# EAGLE design PCB_Plate (EAGLE 5.11)
CAPACITANCE: ?; DESCRIPTION: Intertia and Localization Interfaces; NOTES: No Stuff; REV: A

## Sheet 1 of 7
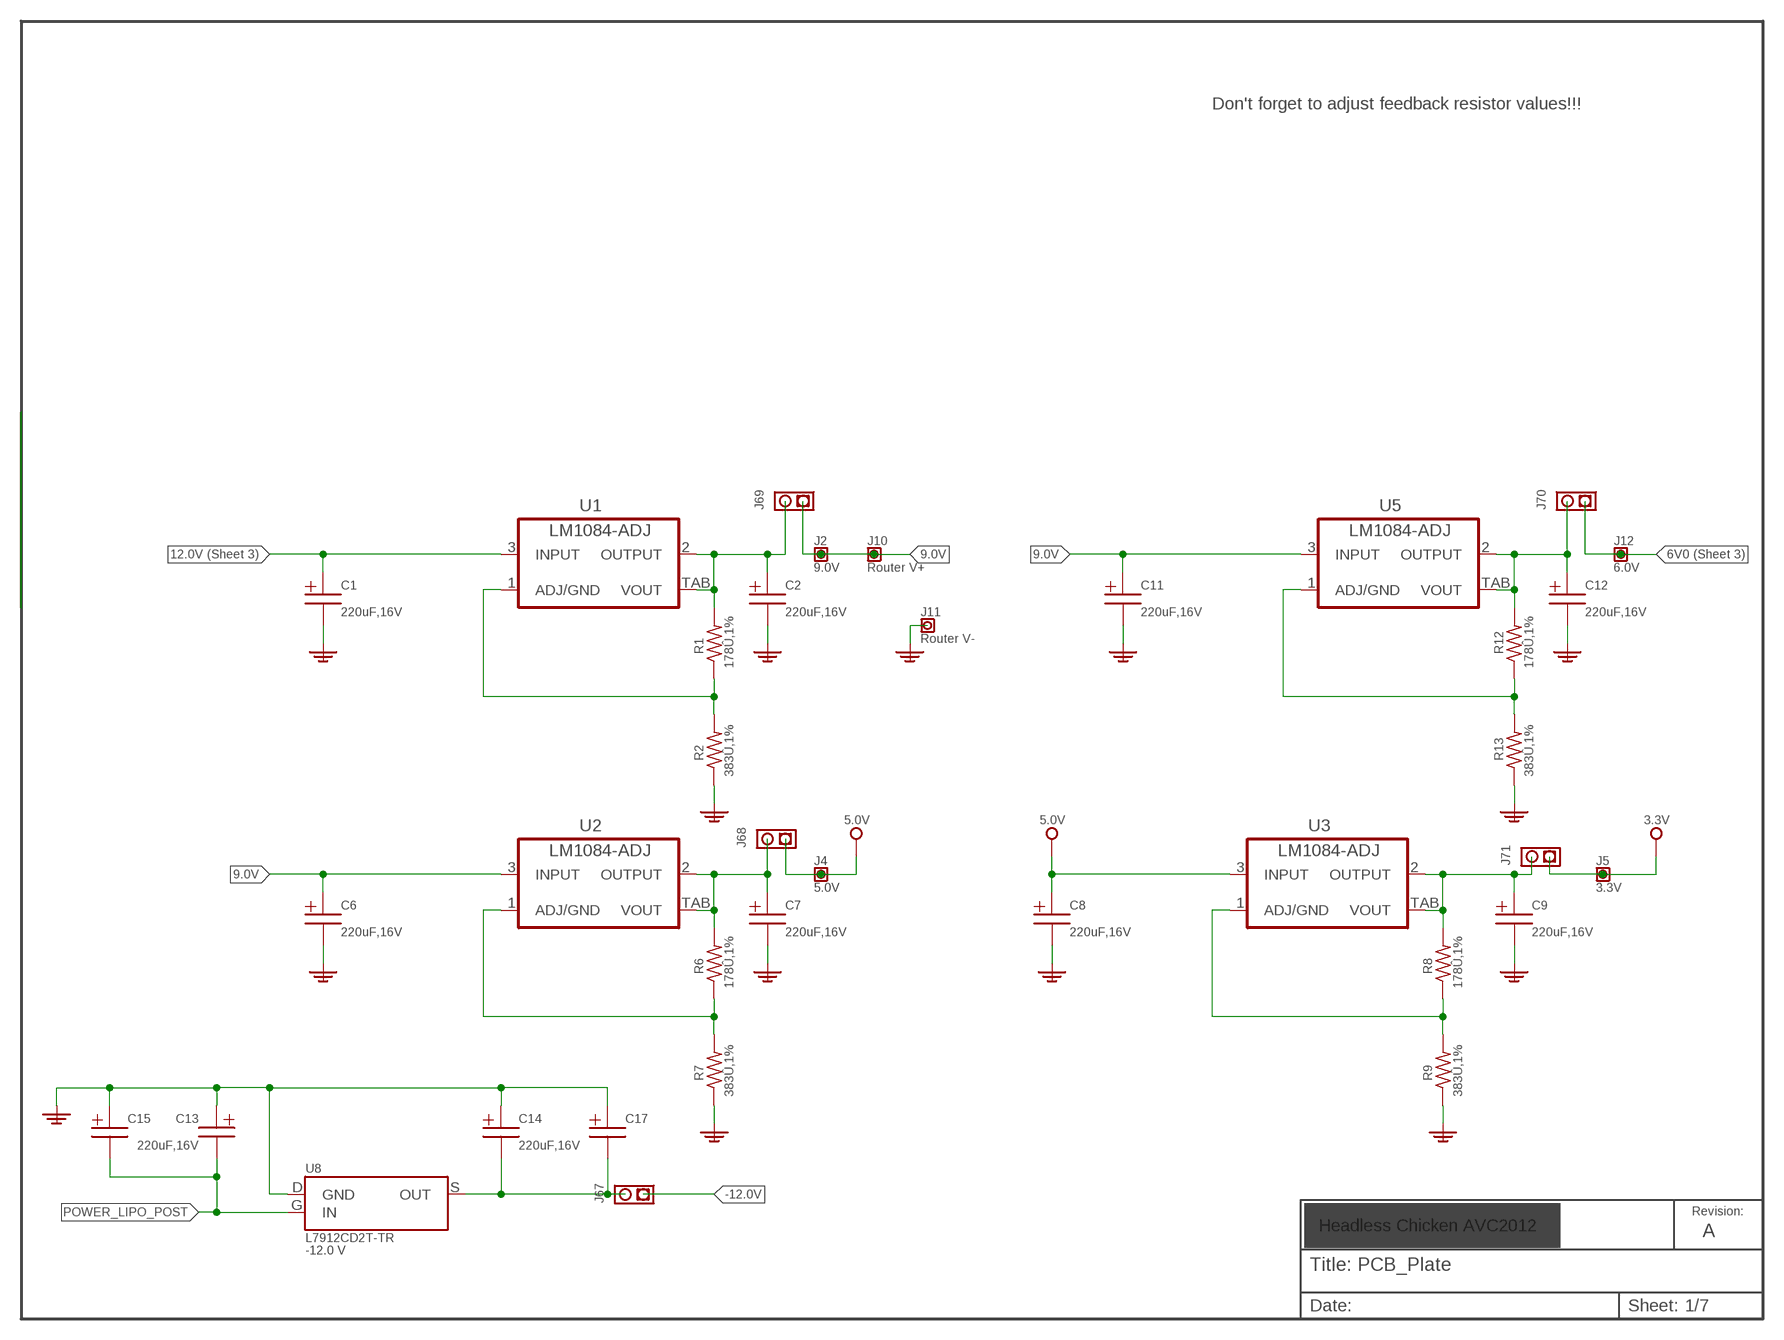
[diagram p0: schematic, sheet 1]

### Parts
C1  T491D227K016ZT  [SMC_D]
C2  T491D227K016ZT  [SMC_D]
C6  T491D227K016ZT  [SMC_D]
C7  T491D227K016ZT  [SMC_D]
C8  T491D227K016ZT  [SMC_D]
C9  T491D227K016ZT  [SMC_D]
C11  T491D227K016ZT  [SMC_D]
C12  T491D227K016ZT  [SMC_D]
C13  T491D227K016ZT  [SMC_D]
C14  T491D227K016ZT  [SMC_D]
C15  CAP_POLARIZED  [PANASONIC_NHG_A]
C17  CAP_POLARIZED  [PANASONIC_NHG_A]
J2  9.0V  BOARD00003WVALUE  [TSW1X1_VAL]
J4  5.0V  BOARD00003WVALUE  [TSW1X1_VAL]
J5  3.3V  BOARD00003WVALUE  [TSW1X1_VAL]
J10  Router V+  BOARD00003WVALUE  [TSW1X1_VAL]
J11  Router V-  BOARD00003WVALUE  [TSW1X1_VAL]
J12  6.0V  BOARD00003WVALUE  [TSW1X1_VAL]
J67  BOARD00012  [TSW1X2]
J68  BOARD00012  [TSW1X2]
J69  BOARD00012  [TSW1X2]
J70  BOARD00012  [TSW1X2]
J71  BOARD00012  [TSW1X2]
R1  ERJ-3EKF1780V  [R0603@1]
R2  on  ERJ-3EKF3830V  [R0603@1]
R6  ERJ-3EKF1780V  [R0603@1]
R7  on  ERJ-3EKF3830V  [R0603@1]
R8  ERJ-3EKF1780V  [R0603@1]
R9  on  ERJ-3EKF3830V  [R0603@1]
R12  ERJ-3EKF1780V  [R0603@1]
R13  on  ERJ-3EKF3830V  [R0603@1]
U1  LM1084IS-ADJ  [TO263-3]
U2  LM1084IS-ADJ  [TO263-3]
U3  LM1084IS-ADJ  [TO263-3]
U5  LM1084IS-ADJ  [TO263-3]
U8  L7912CD2T-TR  [D2PACK]

### Nets
3V3: J5.P$1 J71.P$1 ; also sheet 2,3,5,6
5V0: C8.+ J4.P$1 J68.P$1 U3.3(INPUT) ; also sheet 3,5
6V0: J12.P$1 J70.P$1 ; also sheet 3,5
9.0V: C6.+ C11.+ J2.P$1 J10.P$1 J69.P$1 U2.3(INPUT) U5.3(INPUT)
12.0V: C1.+ U1.3(INPUT) ; also sheet 3,4
-12.0V: J67.P$1
GND: C1.- C2.- C6.- C7.- C8.- C9.- C11.- C12.- C13.+ C14.+ C15.+ C17.+ J11.P$1 R2.1 R7.1 R9.1 R13.1 U8.D(GND) ; also sheet 2,3,4,5,6
N$1: R1.1 R2.2 U1.1(ADJ/GND)
N$6: R6.1 R7.2 U2.1(ADJ/GND)
N$7: R8.1 R9.2 U3.1(ADJ/GND)
N$8: R12.1 R13.2 U5.1(ADJ/GND)
N$101: C12.+ J70.P$2 R12.2 U5.2(OUTPUT) U5.TAB(VOUT)
N$102: C14.- C17.- J67.P$2 U8.S(OUT)
N$106: C7.+ J68.P$2 R6.2 U2.2(OUTPUT) U2.TAB(VOUT)
N$107: C2.+ J69.P$2 R1.2 U1.2(OUTPUT) U1.TAB(VOUT)
N$109: C9.+ J71.P$2 R8.2 U3.2(OUTPUT) U3.TAB(VOUT)
POWER_LIPO_POST: C13.- C15.- U8.G(IN) ; also sheet 4

### Notes on the sheet
- Don't forget to adjust feedback resistor values!!!
- Headless Chicken AVC2012 | Headless Chicken AVC2012

## Sheet 2 of 7
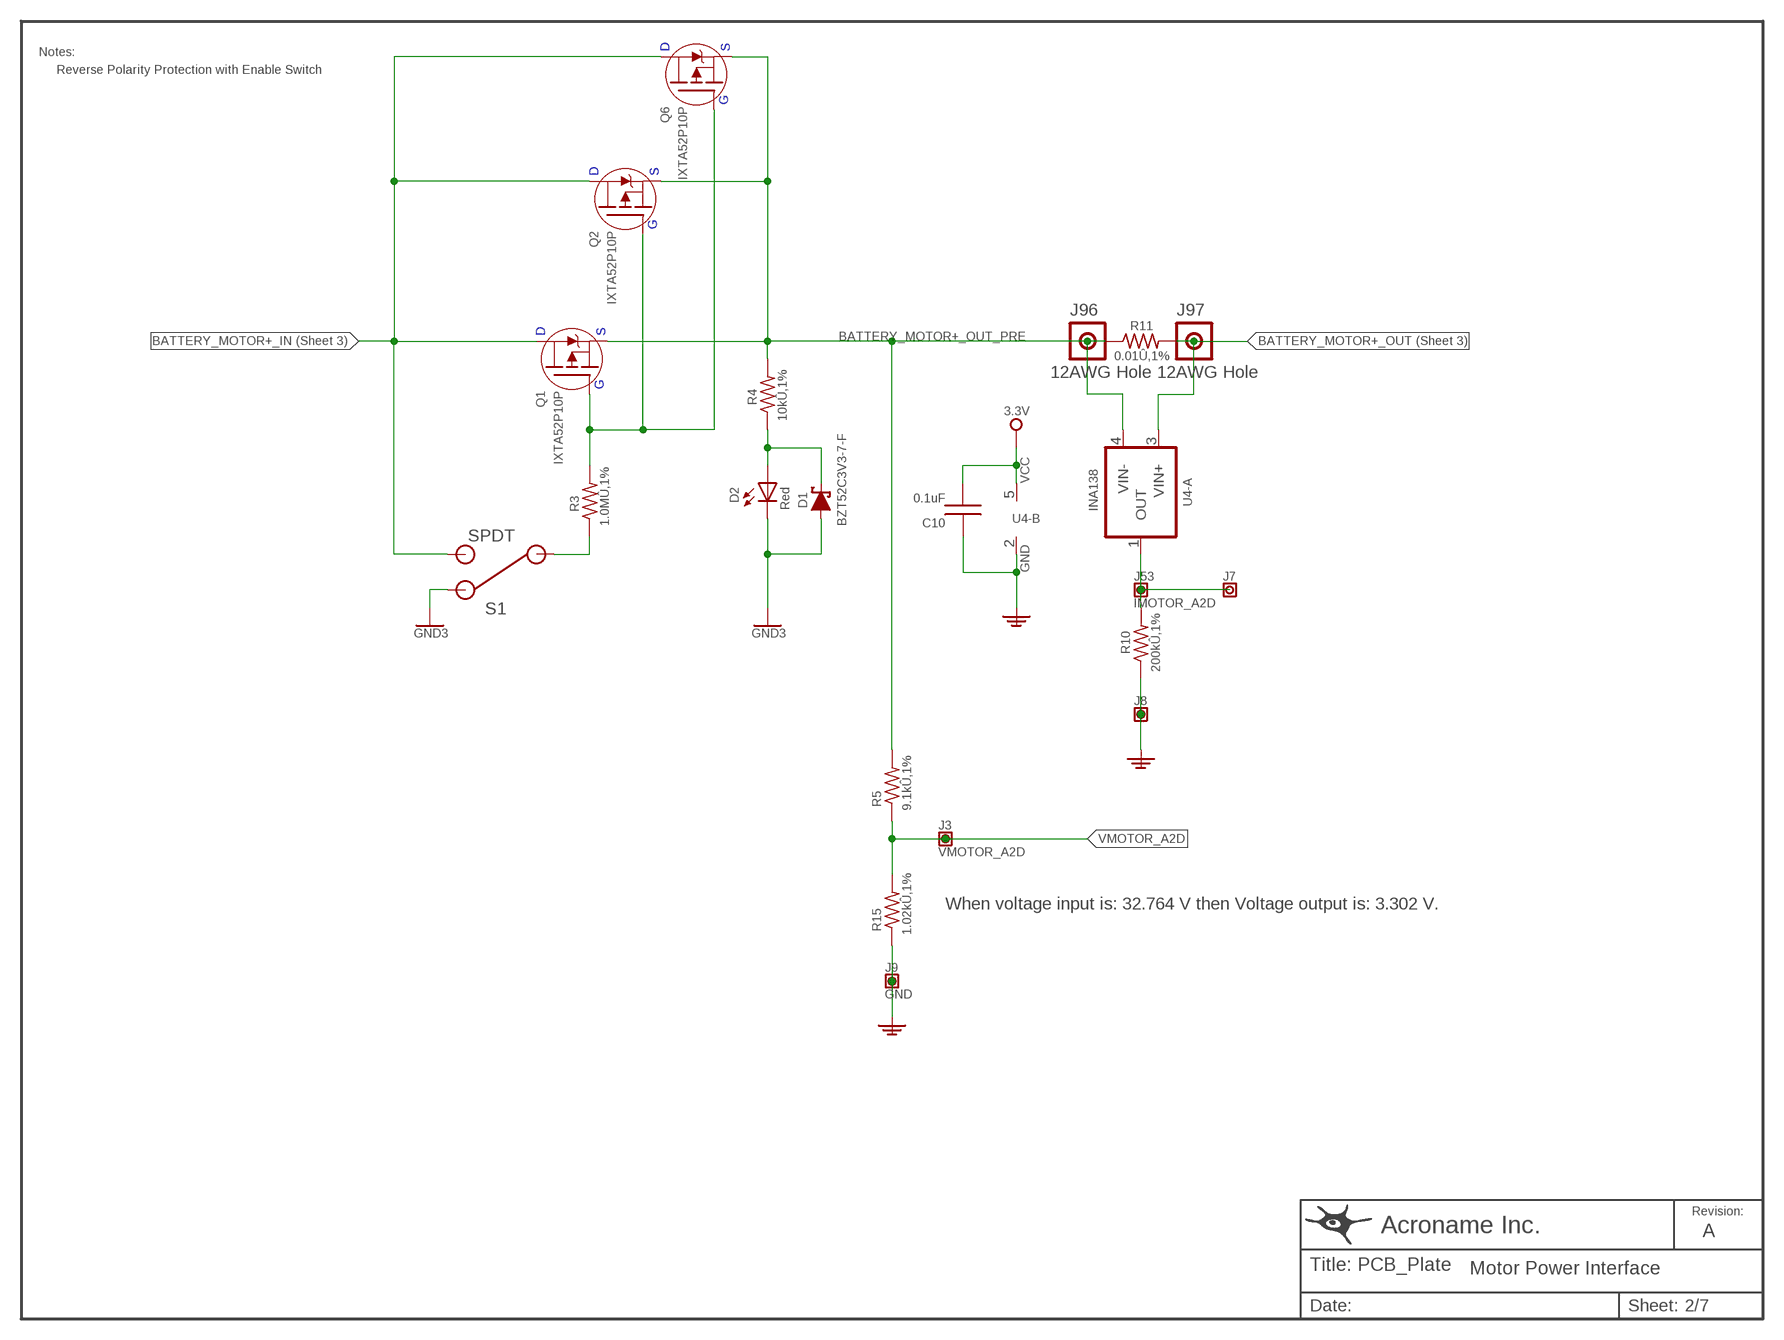
[diagram p1: schematic, sheet 2]

### Parts
C10  PCAPI00015  [C0603]
D1  BZT52C3V3-7-F  [SOD123]
D2  PDIOD00001  [CHIPLED_0805]
J3  VMOTOR_A2D  BOARD00003WVALUE  [TSW1X1_VAL]
J7  BOARD00003WVALUE  [TSW1X1_VAL]
J8  BOARD00003WVALUE  [TSW1X1_VAL]
J9  GND  BOARD00003WVALUE  [TSW1X1_VAL]
J53  IMOTOR_A2D  BOARD00003WVALUE  [TSW1X1_VAL]
J96  BOARD00008  [TSW1X1_12AWG]
J97  BOARD00008  [TSW1X1_12AWG]
Q1  IXTA52P10P  [D2PACK]
Q2  IXTA52P10P  [D2PACK]
Q6  IXTA52P10P  [D2PACK]
R3  ERJ-3EKF1004V  [R0603]
R4  PRESI00005  [R0603]
R5  ERJ-2RKF9101X  [R0402]
R10  PRESI00018  [R0603]
R11  PRESI00041  [R4527]
R15  ERJ-2RKF1021X  [R0402]
S1  PMISC00005  [SPDTRA]
U4  PCHIP00026  [SOT23-5]

### Nets
3V3: C10.2 U4.5(-B:VCC) ; also sheet 1,3,5,6
BATTERY_MOTOR+_IN: Q1.D Q2.D Q6.D S1.3 ; also sheet 3
BATTERY_MOTOR+_OUT: J97.P$1 R11.2 U4.3(-A:VIN+) ; also sheet 3
BATTERY_MOTOR+_OUT_PRE: J96.P$1 Q1.S Q2.S Q6.S R4.2 R5.2 R11.1 U4.4(-A:VIN-)
GND: C10.1 J8.P$1 J9.P$1 R10.1 R15.1 U4.2(-B:GND) ; also sheet 1,3,4,5,6
GND3: D1.C(A) D2.C S1.1 ; also sheet 3
IMOTOR_A2D: J7.P$1 J53.P$1 R10.2 U4.1(-A:OUT)
N$3: Q1.G Q2.G Q6.G R3.2
N$4: D1.A(C) D2.A R4.1
N$5: R3.1 S1.2
VMOTOR_A2D: J3.P$1 R5.1 R15.2
Unconnected: S1.4 S1.5

### Notes on the sheet
- Notes:
- Reverse Polarity Protection with Enable Switch
- When voltage input is: 32.764 V then Voltage output is: 3.302 V.
- Motor Power Interface

## Sheet 3 of 7
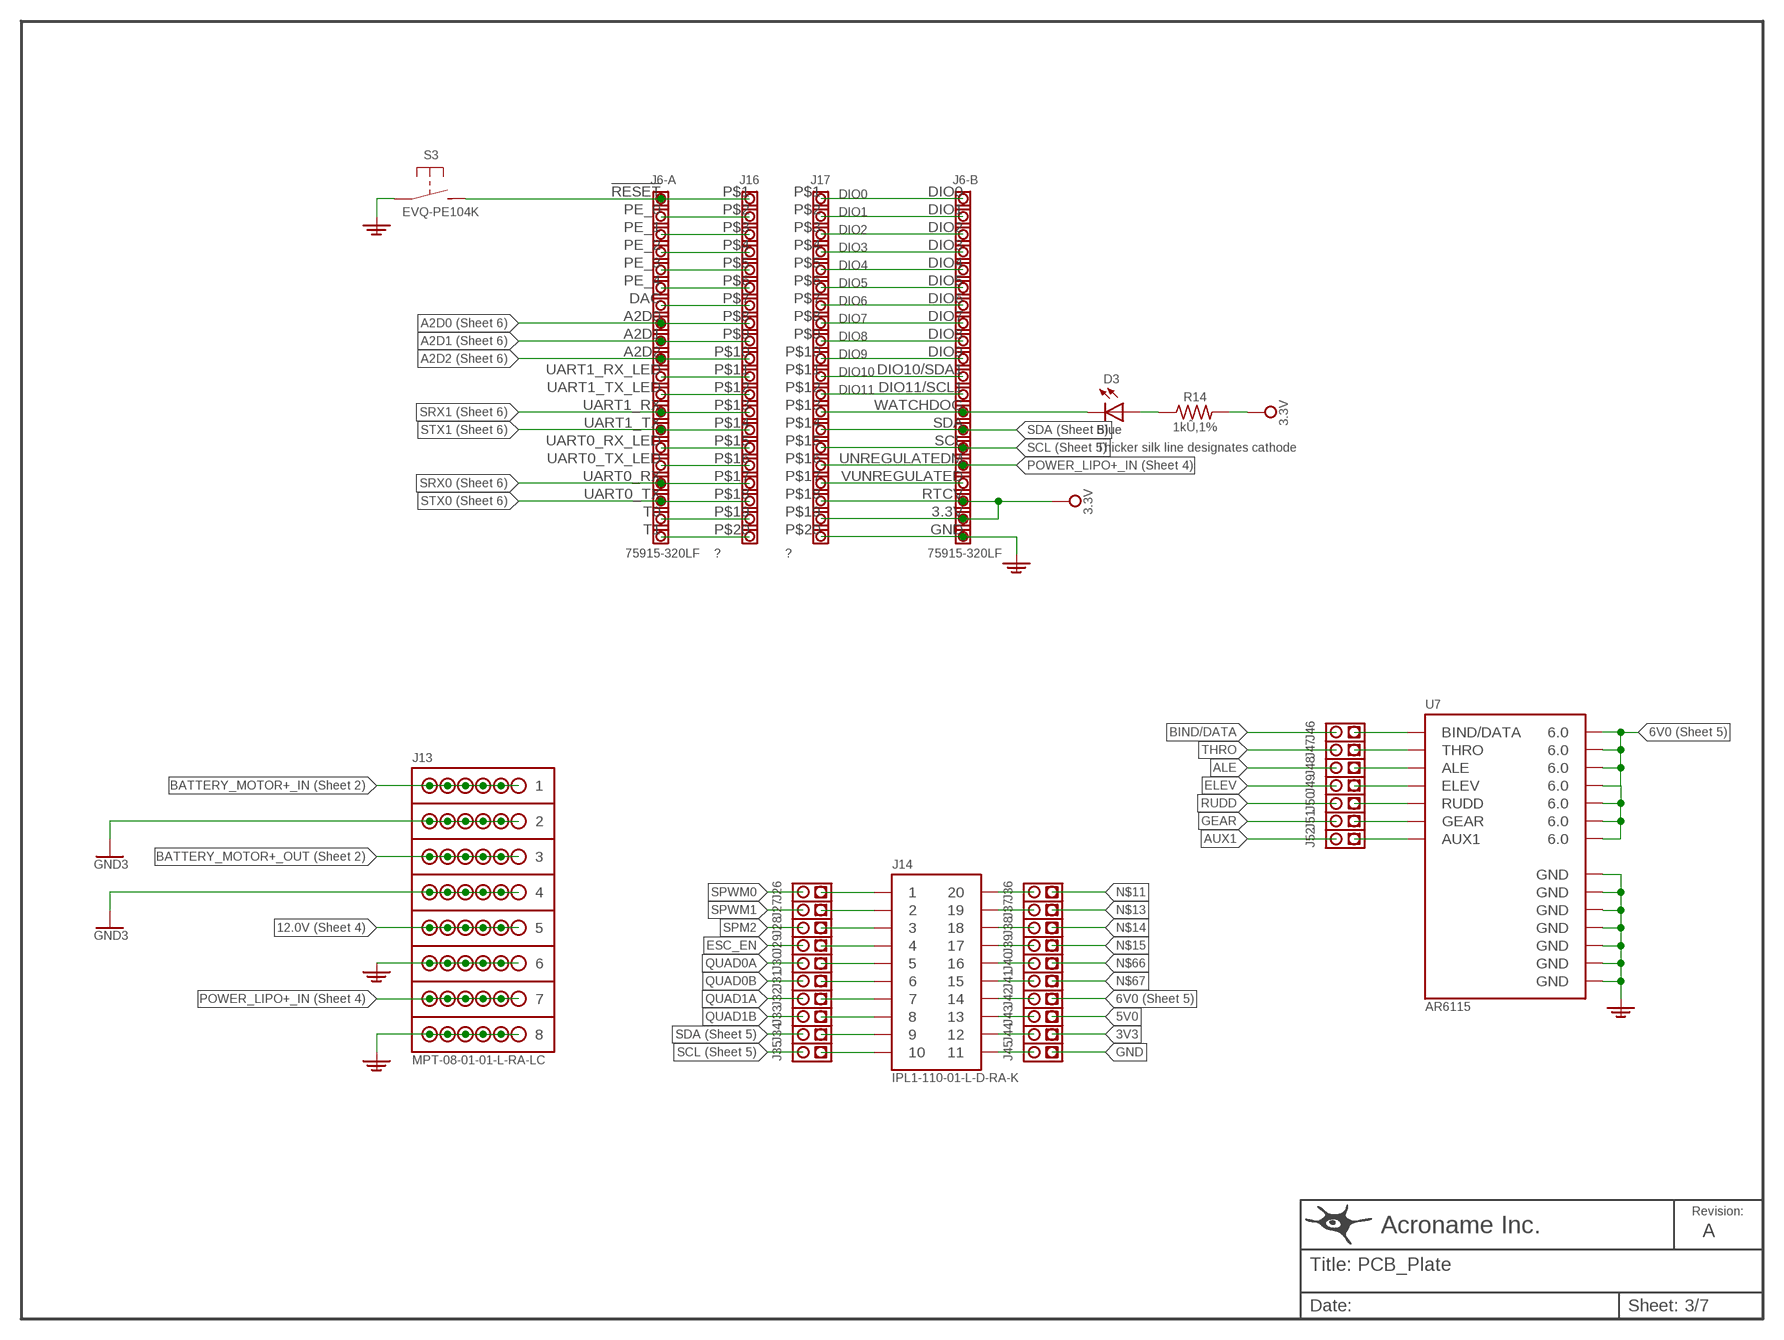
[diagram p2: schematic, sheet 3]

### Parts
D3  LTST-C171TBKT  [CHIPLED_0805]
J6  BRAINSTEMSOCKET_FEMALE  [BRAINSTEMSOCKET]
J13  MPT-08-01-01-L-RA-LC  [MPT-08-XX-X-RA-XX]
J14  IPL1-1XX-02-XXX-DH-K-XX-MKT  [IPL1-110-01-S-RA]
J16  TSW1X20  [TSW1X20]
J17  TSW1X20  [TSW1X20]
J26  BOARD00012  [TSW1X2]
J27  BOARD00012  [TSW1X2]
J28  BOARD00012  [TSW1X2]
J29  BOARD00012  [TSW1X2]
J30  BOARD00012  [TSW1X2]
J31  BOARD00012  [TSW1X2]
J32  BOARD00012  [TSW1X2]
J33  BOARD00012  [TSW1X2]
J34  BOARD00012  [TSW1X2]
J35  BOARD00012  [TSW1X2]
J36  BOARD00012  [TSW1X2]
J37  BOARD00012  [TSW1X2]
J38  BOARD00012  [TSW1X2]
J39  BOARD00012  [TSW1X2]
J40  BOARD00012  [TSW1X2]
J41  BOARD00012  [TSW1X2]
J42  BOARD00012  [TSW1X2]
J43  BOARD00012  [TSW1X2]
J44  BOARD00012  [TSW1X2]
J45  BOARD00012  [TSW1X2]
J46  BOARD00012  [TSW1X2]
J47  BOARD00012  [TSW1X2]
J48  BOARD00012  [TSW1X2]
J49  BOARD00012  [TSW1X2]
J50  BOARD00012  [TSW1X2]
J51  BOARD00012  [TSW1X2]
J52  BOARD00012  [TSW1X2]
R14  PRESI00006  [R0603]
S3  EVQ-PE104K  [SPST-NO]
U7  AR6115  [AR6115]

### Nets
3V3: J6.3.3V J6.RTCV J17.P$18 J17.P$19 J44.P$1 R14.2 ; also sheet 1,2,5,6
5V0: J43.P$1 ; also sheet 1,5
6V0: J42.P$1 U7.VCC@1(6.0) U7.VCC@2(6.0) U7.VCC@3(6.0) U7.VCC@4(6.0) U7.VCC@5(6.0) U7.VCC@6(6.0) U7.VCC@7(6.0) ; also sheet 1,5
12.0V: J13.5@0 J13.5@1 J13.5@2 J13.5@3 J13.5@4 J13.5@5 ; also sheet 1,4
!RESET: J6.!RESET J16.P$1 S3.P$2(S)
A2D0: J6.A2D0 J16.P$8 ; also sheet 6
A2D1: J6.A2D1 J16.P$9 ; also sheet 6
A2D2: J6.A2D2 J16.P$10 ; also sheet 6
ALE: J48.P$2
AUX1: J52.P$2
BATTERY_MOTOR+_IN: J13.1@0 J13.1@1 J13.1@2 J13.1@3 J13.1@4 J13.1@5 ; also sheet 2
BATTERY_MOTOR+_OUT: J13.3@0 J13.3@1 J13.3@2 J13.3@3 J13.3@4 J13.3@5 ; also sheet 2
BIND/DATA: J46.P$2
DIO0: J6.DIO0 J17.P$1 ; also sheet 5
DIO1: J6.DIO1 J17.P$2 ; also sheet 5
DIO2: J6.DIO2 J17.P$3 ; also sheet 5
DIO3: J6.DIO3 J17.P$4 ; also sheet 5
DIO4: J6.DIO4 J17.P$5 ; also sheet 5
DIO5: J6.DIO5 J17.P$6 ; also sheet 5
DIO6: J6.DIO6 J17.P$7
DIO7: J6.DIO7 J17.P$8
DIO8: J6.DIO8 J17.P$9
DIO9: J6.DIO9 J17.P$10
DIO10: J6.DIO10/SDA1 J17.P$11
DIO11: J6.DIO11/SCL1 J17.P$12
ELEV: J49.P$2
ESC_EN: J29.P$2
GEAR: J51.P$2
GND: J6.GND J13.6@0 J13.6@1 J13.6@2 J13.6@3 J13.6@4 J13.6@5 J13.8@0 J13.8@1 J13.8@2 J13.8@3 J13.8@4 J13.8@5 J17.P$20 J45.P$1 S3.P$1(P) U7.GND@1(GND) U7.GND@2(GND) U7.GND@3(GND) U7.GND@4(GND) U7.GND@5(GND) U7.GND@6(GND) U7.GND@7(GND) ; also sheet 1,2,4,5,6
GND3: J13.2@0 J13.2@1 J13.2@2 J13.2@3 J13.2@4 J13.2@5 J13.4@0 J13.4@1 J13.4@2 J13.4@3 J13.4@4 J13.4@5 ; also sheet 2
N$9: D3.A R14.1
N$11: J36.P$1
N$12: D3.C J6.WATCHDOG J17.P$13
N$13: J37.P$1
N$14: J38.P$1
N$15: J39.P$1
N$16: J6.PE_0 J16.P$2
N$17: J6.PE_1 J16.P$3
N$18: J6.PE_2 J16.P$4
N$19: J6.PE_3 J16.P$5
N$20: J6.PE_4 J16.P$6
N$21: J6.DAC J16.P$7
N$22: J6.UART1_RX_LED J16.P$11
N$23: J6.UART1_TX_LED J16.P$12
N$26: J6.UART0_RX_LED J16.P$15
N$27: J6.UART0_TX_LED J16.P$16
N$30: J6.T0 J16.P$19
N$31: J6.T1 J16.P$20
N$44: J6.VUNREGULATED J17.P$17
N$46: J14.1 J26.P$1
N$56: J14.2 J27.P$1
N$57: J14.3 J28.P$1
N$59: J14.4 J29.P$1
N$60: J14.5 J30.P$1
N$61: J14.6 J31.P$1
N$62: J14.7 J32.P$1
N$63: J14.8 J33.P$1
N$64: J14.9 J34.P$1
N$65: J14.10 J35.P$1
N$66: J40.P$1
N$67: J41.P$1
N$68: J14.20 J36.P$2
N$69: J14.19 J37.P$2
N$70: J14.18 J38.P$2
N$71: J14.17 J39.P$2
N$72: J14.16 J40.P$2
N$73: J14.15 J41.P$2
N$74: J14.14 J42.P$2
N$75: J14.13 J43.P$2
N$76: J14.12 J44.P$2
N$77: J14.11 J45.P$2
N$78: J46.P$1 U7.BIND(BIND/DATA)
N$79: J47.P$1 U7.THRO
N$80: J48.P$1 U7.ALE
N$81: J49.P$1 U7.ELEV
N$82: J50.P$1 U7.RUDD
N$83: J51.P$1 U7.GEAR
N$84: J52.P$1 U7.AUX1
POWER_LIPO+_IN: J6.UNREGULATEDM J13.7@0 J13.7@1 J13.7@2 J13.7@3 J13.7@4 J13.7@5 J17.P$16 ; also sheet 4
QUAD0A: J30.P$2
QUAD0B: J31.P$2
QUAD1A: J32.P$2
QUAD1B: J33.P$2
RUDD: J50.P$2
SCL: J6.SCL J17.P$15 J35.P$2 ; also sheet 5,6
SDA: J6.SDA J17.P$14 J34.P$2 ; also sheet 5,6
SPM2: J28.P$2
SPWM0: J26.P$2
SPWM1: J27.P$2
SRX0: J6.UART0_RX J16.P$17 ; also sheet 6
SRX1: J6.UART1_RX J16.P$13 ; also sheet 6
STX0: J6.UART0_TX J16.P$18 ; also sheet 6
STX1: J6.UART1_TX J16.P$14 ; also sheet 6
THRO: J47.P$2

## Sheet 4 of 7
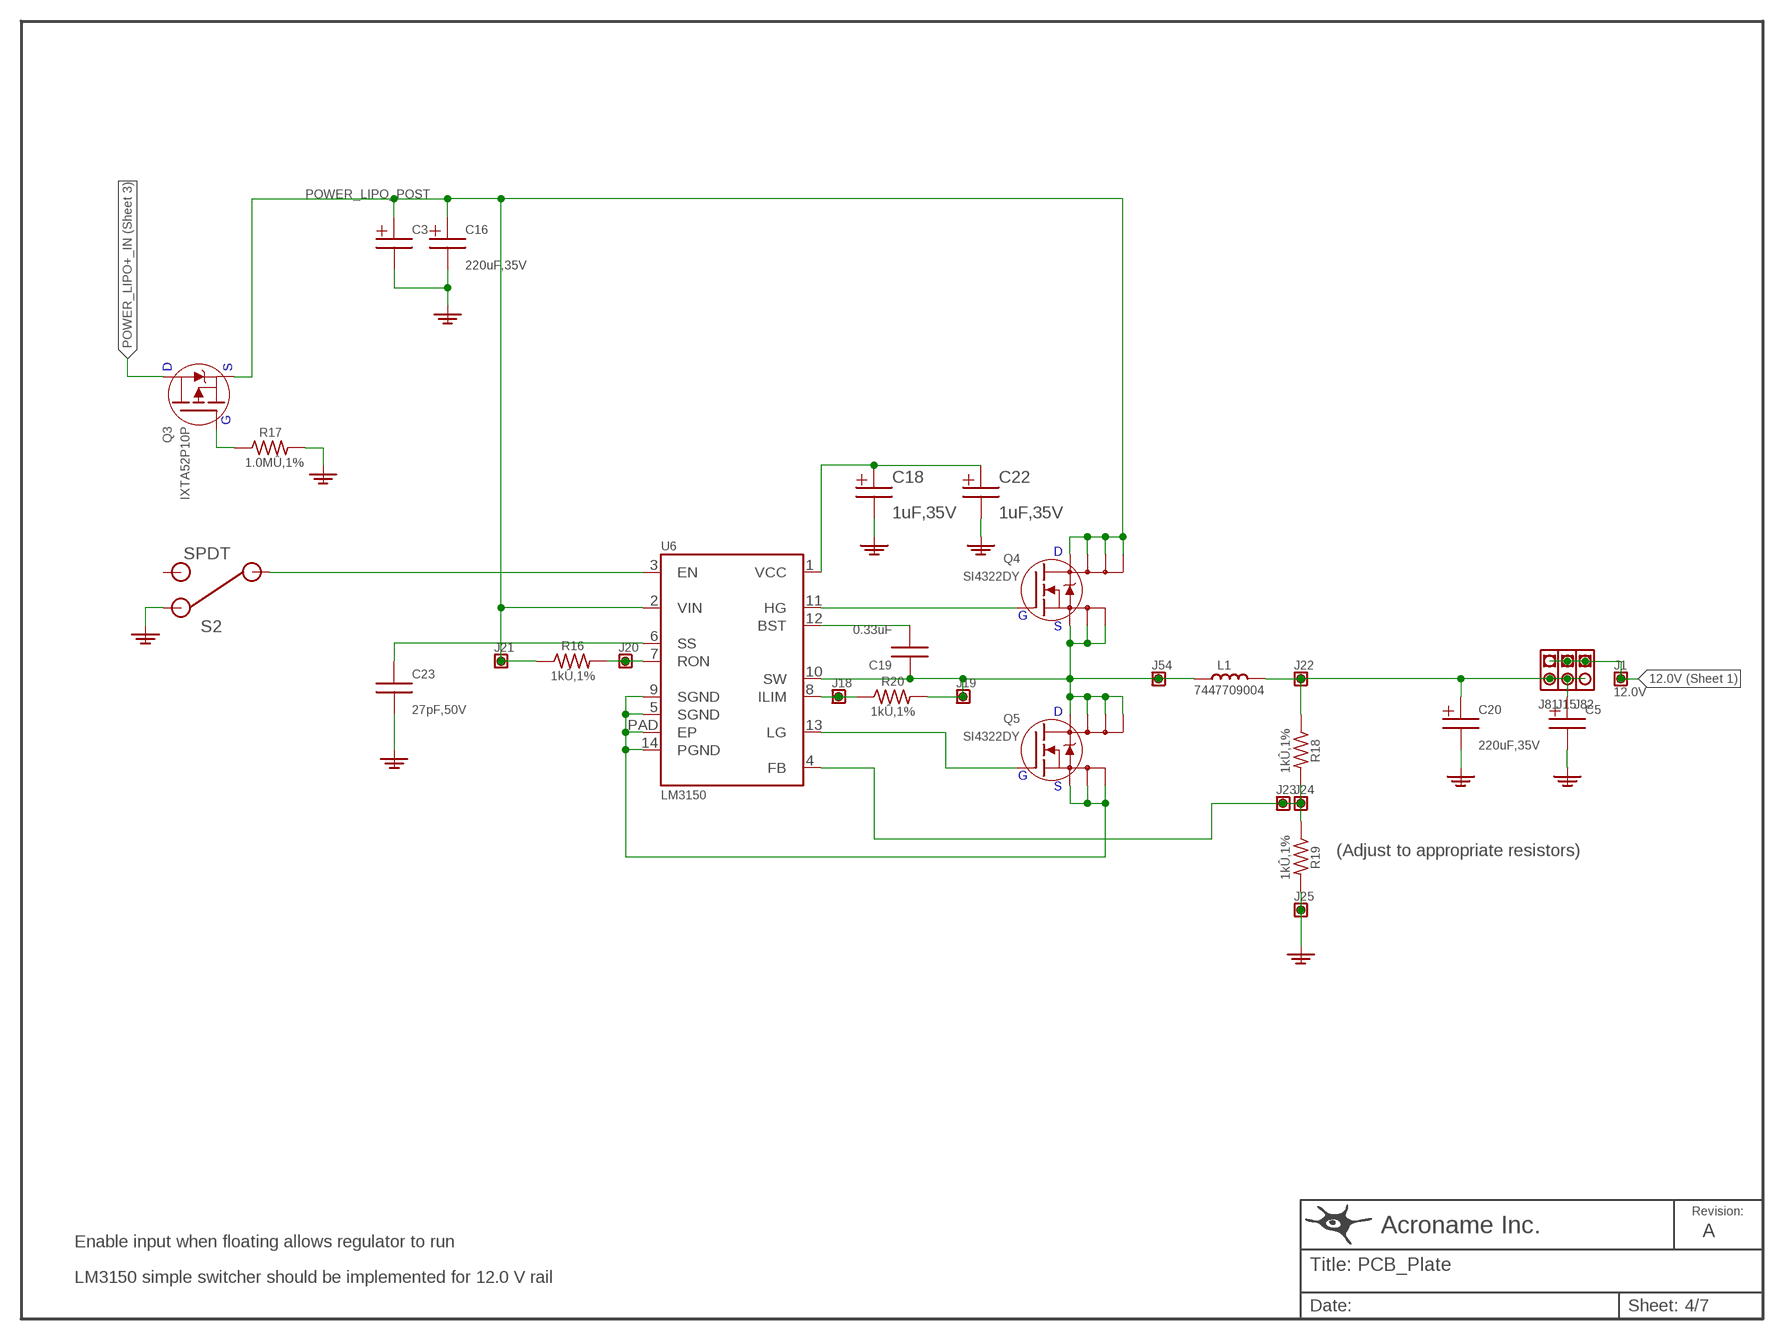
[diagram p3: schematic, sheet 4]

### Parts
C3  CAP_POLARIZED  [PANASONIC_NHG_A]
C5  CAP_POLARIZED  [PANASONIC_NHG_A]
C16  PCAPI00020  [PANASONIC_G]
C18  T491B105K035AT  [T491]
C19  PCAPI00005  [C0603]
C20  PCAPI00020  [PANASONIC_G]
C22  T491B105K035AT  [T491]
C23  ECJ-1VC1H270J  [C0603]
J1  12.0V  BOARD00003WVALUE  [TSW1X1_VAL]
J15  BOARD00012  [TSW1X2]
J18  BOARD00003  [TSW1X1]
J19  BOARD00003  [TSW1X1]
J20  BOARD00003  [TSW1X1]
J21  BOARD00003  [TSW1X1]
J22  BOARD00003  [TSW1X1]
J23  BOARD00003  [TSW1X1]
J24  BOARD00003  [TSW1X1]
J25  BOARD00003  [TSW1X1]
J54  BOARD00003  [TSW1X1]
J81  BOARD00012  [TSW1X2]
J82  BOARD00012  [TSW1X2]
L1  7447709004  [7447709004]
Q3  IXTA52P10P  [D2PACK]
Q4  SI4322DY  [SO-08]
Q5  SI4322DY  [SO-08]
R16  PRESI00006  [R0603]
R17  ERJ-3EKF1004V  [R0603]
R18  PRESI00006  [R0603]
R19  PRESI00006  [R0603]
R20  PRESI00006  [R0603]
S2  PMISC00005  [SPDTRA]
U6  LM3150  [TSSOP14EXP]

### Nets
12.0V: J1.P$1 J15.P$1 J81.P$1 J82.P$1 ; also sheet 1,3
GND: C3.- C5.- C16.- C18.- C20.- C22.- C23.2 J25.P$1 R17.2 R19.2 S2.1 ; also sheet 1,2,3,5,6
N$2: S2.2 U6.3(EN)
N$42: C5.+ C20.+ J15.P$2 J22.P$1 J81.P$2 J82.P$2 L1.2 R18.1
N$45: C18.+ C22.+ U6.1(VCC)
N$47: Q5.1(SA) Q5.2(SB) Q5.3(SC) U6.5(SGND) U6.9(SGND) U6.14(PGND) U6.PAD(EP)
N$48: Q5.4(G) U6.13(LG)
N$49: Q4.4(G) U6.11(HG)
N$50: Q3.G R17.1
N$51: J20.P$1 R16.2 U6.7(RON)
N$52: C19.1 J19.P$1 J54.P$1 L1.1 Q4.1(SA) Q4.2(SB) Q4.3(SC) Q5.5(DA) Q5.6(DB) Q5.7(DC) Q5.8(DD) R20.2 U6.10(SW)
N$53: C19.2 U6.12(BST)
N$54: J23.P$1 J24.P$1 R18.2 R19.1 U6.4(FB)
N$55: J18.P$1 R20.1 U6.8(ILIM)
N$58: C23.1 U6.6(SS)
POWER_LIPO+_IN: Q3.D ; also sheet 3
POWER_LIPO_POST: C3.+ C16.+ J21.P$1 Q3.S Q4.5(DA) Q4.6(DB) Q4.7(DC) Q4.8(DD) R16.1 U6.2(VIN) ; also sheet 1
Unconnected: S2.3 S2.4 S2.5

### Notes on the sheet
- (Adjust to appropriate resistors)
- Enable input when floating allows regulator to run
- LM3150 simple switcher should be implemented for 12.0 V rail

## Sheet 5 of 7
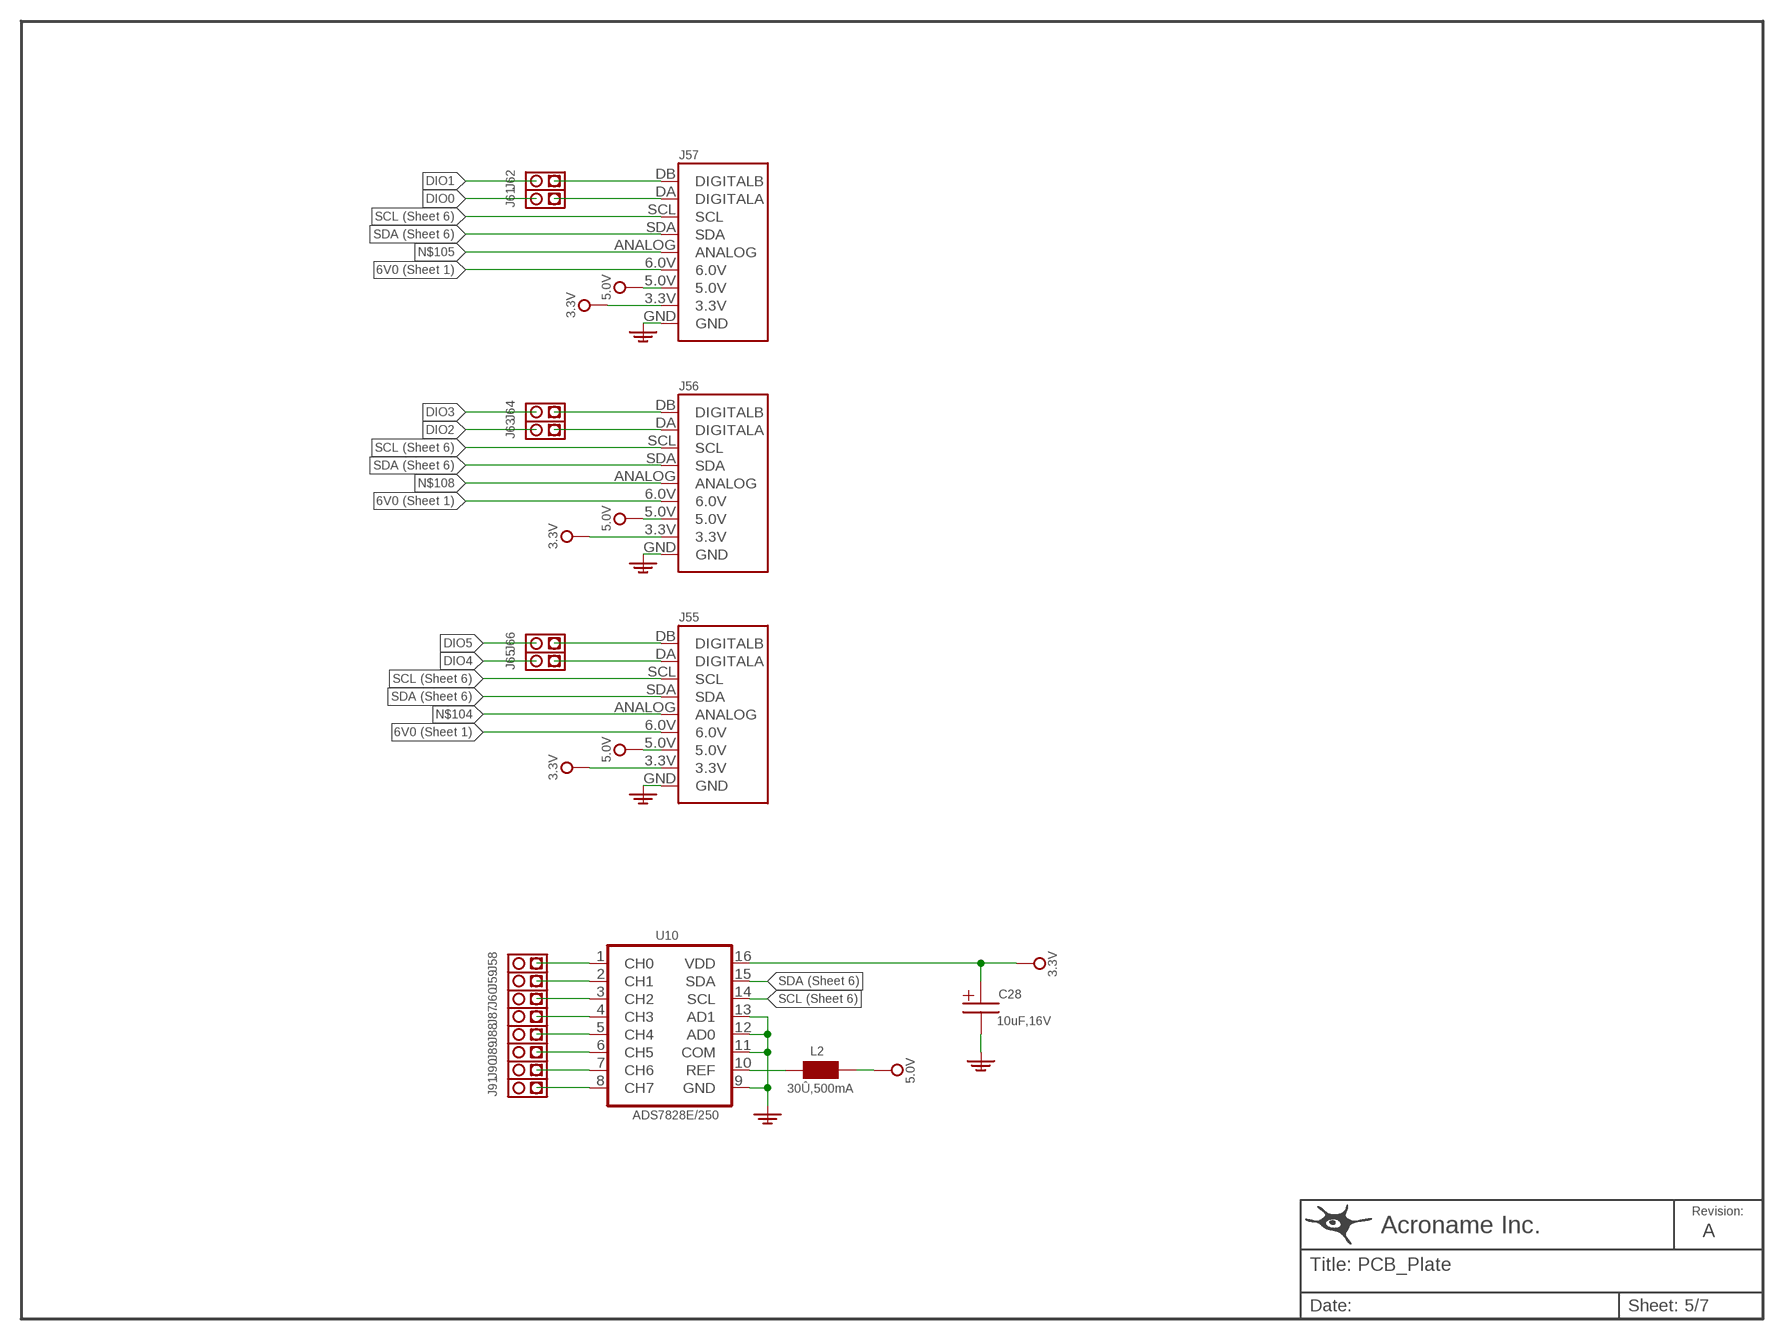
[diagram p4: schematic, sheet 5]

### Parts
C28  T491A106K010AT  [SMC_A]
J55  SENSOR_INTERFACE  [SENSOR_INTERFACE]
J56  SENSOR_INTERFACE  [SENSOR_INTERFACE]
J57  SENSOR_INTERFACE  [SENSOR_INTERFACE]
J58  BOARD00012  [TSW1X2]
J59  BOARD00012  [TSW1X2]
J60  BOARD00012  [TSW1X2]
J61  BOARD00012  [TSW1X2]
J62  BOARD00012  [TSW1X2]
J63  BOARD00012  [TSW1X2]
J64  BOARD00012  [TSW1X2]
J65  BOARD00012  [TSW1X2]
J66  BOARD00012  [TSW1X2]
J87  BOARD00012  [TSW1X2]
J88  BOARD00012  [TSW1X2]
J89  BOARD00012  [TSW1X2]
J90  BOARD00012  [TSW1X2]
J91  BOARD00012  [TSW1X2]
L2  PMISC00013  [L0402]
U10  ADS7828E  [TSSOP16]

### Nets
3V3: C28.+ J55.3.3V J56.3.3V J57.3.3V U10.16(VDD) ; also sheet 1,2,3,6
5V0: J55.5.0V J56.5.0V J57.5.0V L2.2 ; also sheet 1,3
6V0: J55.6.0V J56.6.0V J57.6.0V ; also sheet 1,3
DIO0: J61.P$2 ; also sheet 3
DIO1: J62.P$2 ; also sheet 3
DIO2: J63.P$2 ; also sheet 3
DIO3: J64.P$2 ; also sheet 3
DIO4: J65.P$2 ; also sheet 3
DIO5: J66.P$2 ; also sheet 3
GND: C28.- J55.GND J56.GND J57.GND U10.9(GND) U10.11(COM) U10.12(AD0) U10.13(AD1) ; also sheet 1,2,3,4,6
N$25: J58.P$1 U10.1(CH0)
N$41: L2.1 U10.10(REF)
N$87: J59.P$1 U10.2(CH1)
N$88: J57.DA(DIGITALA) J61.P$1
N$89: J57.DB(DIGITALB) J62.P$1
N$90: J60.P$1 U10.3(CH2)
N$91: J87.P$1 U10.4(CH3)
N$92: J55.DA(DIGITALA) J65.P$1
N$93: J55.DB(DIGITALB) J66.P$1
N$94: J56.DA(DIGITALA) J63.P$1
N$95: J56.DB(DIGITALB) J64.P$1
N$96: J88.P$1 U10.5(CH4)
N$97: J89.P$1 U10.6(CH5)
N$98: J90.P$1 U10.7(CH6)
N$99: J91.P$1 U10.8(CH7)
N$104: J55.ANALOG
N$105: J57.ANALOG
N$108: J56.ANALOG
SCL: J55.SCL J56.SCL J57.SCL U10.14(SCL) ; also sheet 3,6
SDA: J55.SDA J56.SDA J57.SDA U10.15(SDA) ; also sheet 3,6
Unconnected: J58.P$2 J59.P$2 J60.P$2 J87.P$2 J88.P$2 J89.P$2 J90.P$2 J91.P$2

## Sheet 6 of 7
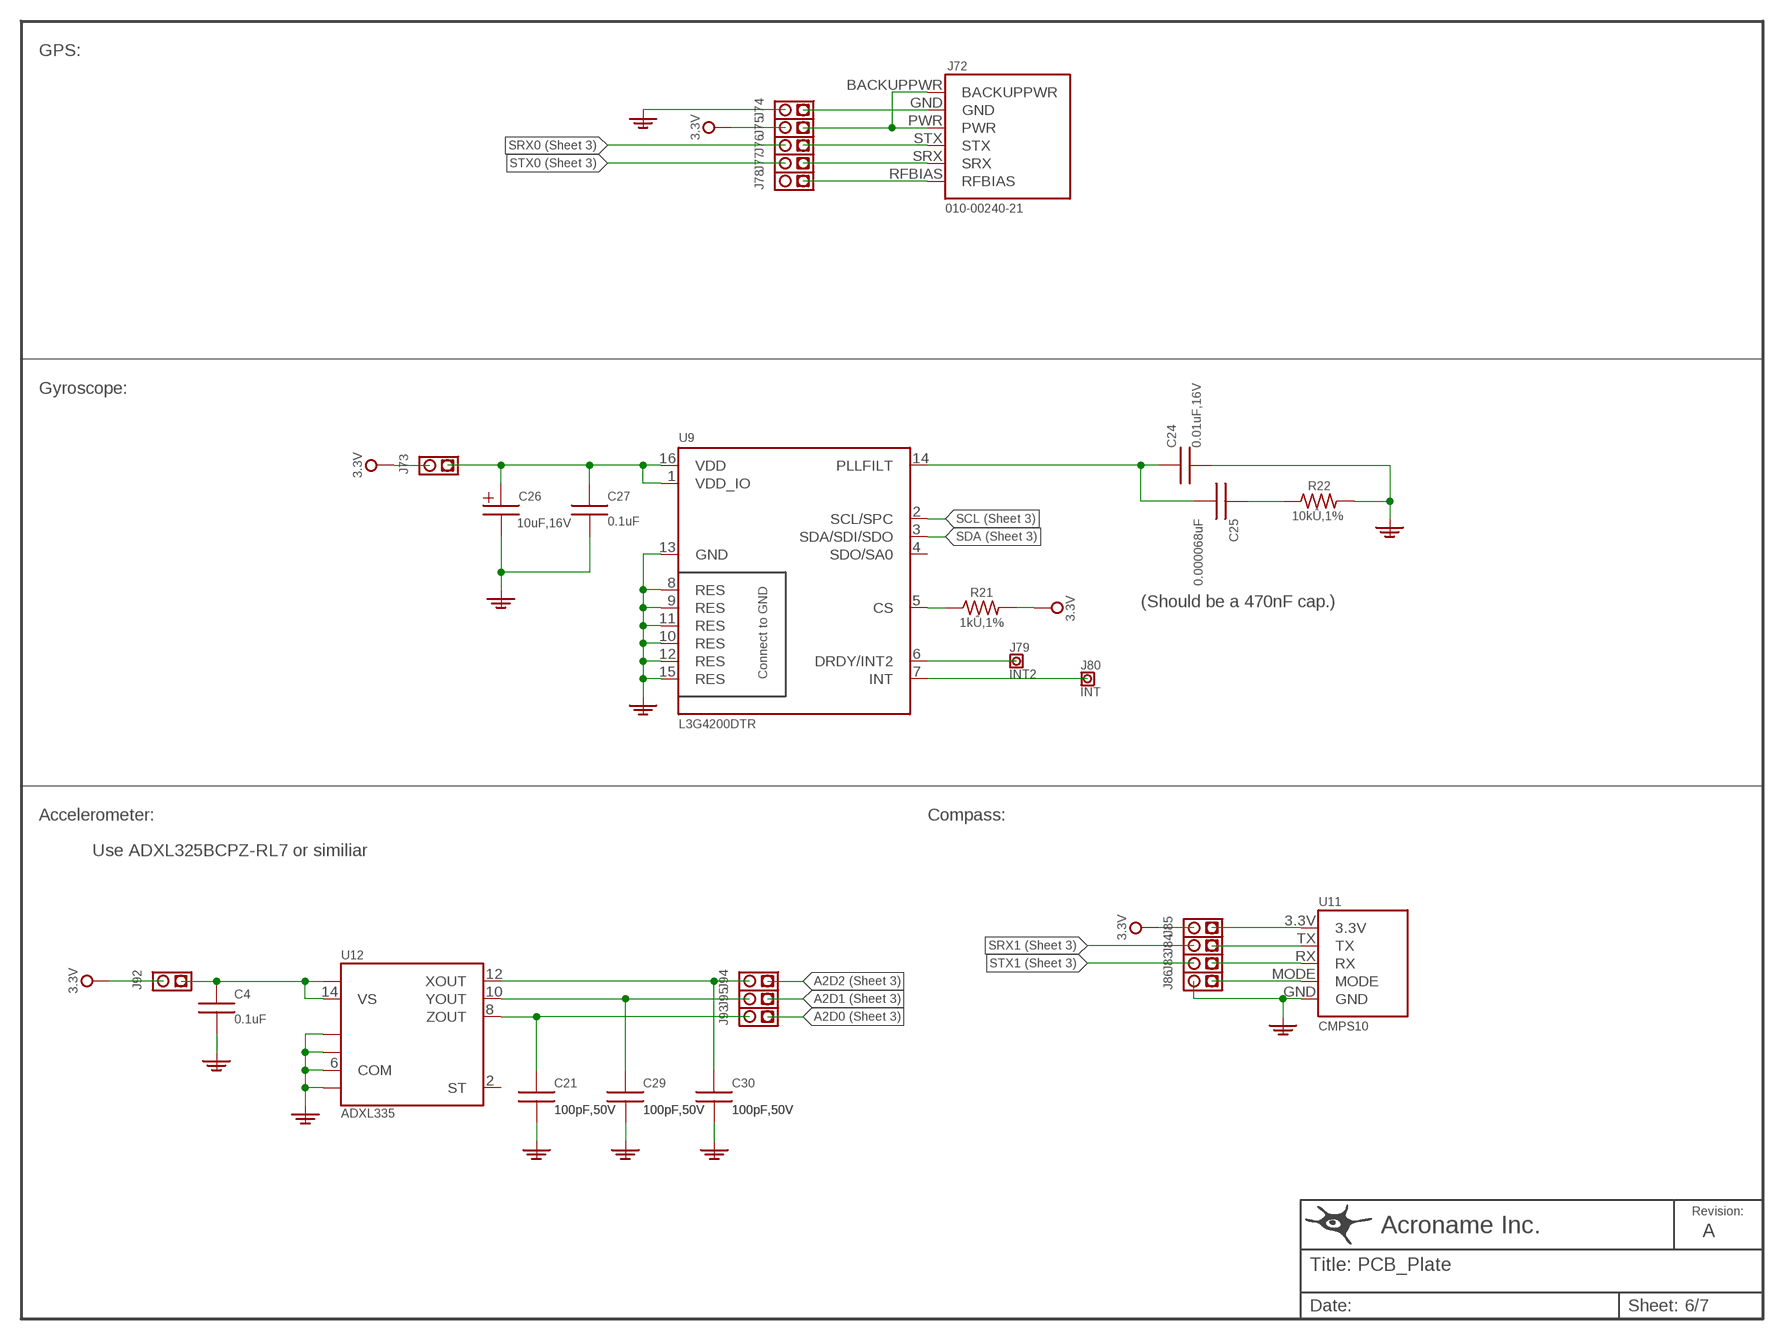
[diagram p5: schematic, sheet 6]

### Parts
C4  PCAPI00015  [C0603]
C21  PCAPI00016  [C0603]
C24  PCAPI00007  [C0603]
C25  PCAPI00023  [C0603]
C26  T491A106K010AT  [SMC_A]
C27  PCAPI00015  [C0603]
C29  PCAPI00016  [C0603]
C30  PCAPI00016  [C0603]
J72  GPS15X  [GPS15]
J73  BOARD00012  [TSW1X2]
J74  BOARD00012  [TSW1X2]
J75  BOARD00012  [TSW1X2]
J76  BOARD00012  [TSW1X2]
J77  BOARD00012  [TSW1X2]
J78  BOARD00012  [TSW1X2]
J79  INT2  BOARD00003WVALUE  [TSW1X1_VAL]
J80  INT  BOARD00003WVALUE  [TSW1X1_VAL]
J83  BOARD00012  [TSW1X2]
J84  BOARD00012  [TSW1X2]
J85  BOARD00012  [TSW1X2]
J86  BOARD00012  [TSW1X2]
J92  BOARD00012  [TSW1X2]
J93  BOARD00012  [TSW1X2]
J94  BOARD00012  [TSW1X2]
J95  BOARD00012  [TSW1X2]
R21  PRESI00006  [R0603]
R22  PRESI00005  [R0603]
U9  L3G4200DTR  [LGA16]
U11  CMPS10  [CMPS10]
U12  ADXL335  [LFCSP-16]

### Nets
3V3: J73.P$2 J75.P$2 J85.P$2 J92.P$2 R21.2 ; also sheet 1,2,3,5
A2D0: J93.P$1 ; also sheet 3
A2D1: J95.P$1 ; also sheet 3
A2D2: J94.P$1 ; also sheet 3
GND: C4.2 C21.2 C24.2 C26.- C27.2 C29.2 C30.2 J74.P$2 J86.P$2 R22.2 U9.8(RES) U9.9(RES) U9.10(RES) U9.11(RES) U9.12(RES) U9.13(GND) U9.15(RES) U11.GND U12.3(COM) U12.5(COM) U12.6(COM) U12.7(COM) ; also sheet 1,2,3,4,5
N$24: J86.P$1 U11.MODE
N$28: C26.+ C27.1 J73.P$1 U9.1(VDD_IO) U9.16(VDD)
N$29: R21.1 U9.5(CS)
N$32: J72.BACKUPPWR J72.PWR J75.P$1
N$33: J72.GND J74.P$1
N$34: J72.STX J76.P$1
N$35: J72.SRX J77.P$1
N$36: J72.RFBIAS J78.P$1
N$37: C24.1 C25.2 U9.14(PLLFILT)
N$38: C25.1 R22.1
N$39: J80.P$1 U9.7(INT)
N$40: J79.P$1 U9.6(DRDY/INT2)
N$43: J85.P$1 U11.3.3V
N$85: J84.P$1 U11.TX
N$86: J83.P$1 U11.RX
N$100: C4.1 J92.P$1 U12.14(VS) U12.15(VS)
N$103: C21.1 J93.P$2 U12.8(ZOUT)
N$110: C29.1 J95.P$2 U12.10(YOUT)
N$111: C30.1 J94.P$2 U12.12(XOUT)
SCL: U9.2(SCL/SPC) ; also sheet 3,5
SDA: U9.3(SDA/SDI/SDO) ; also sheet 3,5
SRX0: J76.P$2 ; also sheet 3
SRX1: J84.P$2 ; also sheet 3
STX0: J77.P$2 ; also sheet 3
STX1: J83.P$2 ; also sheet 3
Unconnected: J78.P$2 U9.4(SDO/SA0) U12.2(ST)

### Notes on the sheet
- GPS:
- Gyroscope:
- (Should be a 470nF cap.)
- Accelerometer: | Compass:
- Use ADXL325BCPZ-RL7 or similiar

## Sheet 7 of 7

## Library data of the parts
C1 C2 C6-C9 C11-C14 = aAcroname:T491D227K016ZT: 220 UF 16V +/-10% Tantalum; ACRONAME: -; CAPACITANCE: 220uF,16V; PARTNUM: T491D227K016ZT; UNITCOST: 0.99
C3 C5 C15 C17 = aAcroname:CAP_POLARIZED: Polarized Capacitor; ACRONAME: -
C4 C10 C27 = aAcroname:PCAPI00015: 0.1UF 25V CERAMIC X7R +/-10%; ACRONAME: PCAPI00015; PARTNUM: ECJ-1VB1E104K
C16 C20 = aAcroname:PCAPI00020: 220UF 35V ELECTROLYTIC LOW ESR +/-20%; ACRONAME: PCAPI00020; PARTNUM: EEETG1V221UP; UNITCOST: ?
C18 C22 = aAcroname:T491B105K035AT: 1.0UF 35V +/-10% TANTALUM
C19 = aAcroname:PCAPI00005: 0.33UF 10V CERAMIC
C21 C29 C30 = aAcroname:PCAPI00016: 0.0001UF 50V CERAMIC X7R +/-10%; ACRONAME: PCAPI00016; PARTNUM: ECJ-1VC1H101J
C23 = aAcroname:ECJ-1VC1H270J: 0.000027 UF 50V CERAMIC; ACRONAME: PCAPI00028; PARTNUM: ECJ-1VC1H270J
C24 = aAcroname:PCAPI00007: 0.01UF 16V CERAMIC X7R +/-10%; ACRONAME: PCAPI00007; PARTNUM: ECJ-1VB1C103K
C25 = aAcroname:PCAPI00023: 0.000068UF 50V CERAMIC +/-5%
C26 C28 = aAcroname:T491A106K010AT: 10UF 16V TANTALUM +/-10%; ACRONAME: PCAPI00032; PARTNUM: T491A106M016AT; UNITCOST: 0.093
D1 = aAcroname:BZT52C3V3-7-F: DIODE ZENER Vz=3.3V 500mW; ACRONAME: -; PARTNUM: BZT52C3V3-7-F
D2 = aAcroname:PDIOD00001: LED SMT Red 0805; ACRONAME: PDIOD00001; NOTES: Thicker silk line designates cathode; PARTNUM: LTST-C171CKT; UNITCOST: 0.06
D3 = aAcroname:LTST-C171TBKT: LED SMT Blue 0805; ACRONAME: PDIOD00013; NOTES: Thicker silk line designates cathode; PARTNUM: LTST-C171TBKT; UNITCOST: 0.31
J1-J5 J7-J12 J53 J79 J80 = aAcroname:BOARD00003: Through hole for 22AWG wire; ACRONAME: -; NOTES: No Stuff; PARTNUM: -; UNITCOST: 0.0
J6 = aAcroname:BRAINSTEMSOCKET_FEMALE: 0.1 inch female header pair for interfacing socket.; ACRONAME: PCONN00082; ALTERNATIVE: SSW-120-01-G-S; PARTNUM: 75915-320LF; UNITCOST: 1.351
J13 = avc:MPT-08-01-01-L-RA-LC: Samtec PowerStrip/25 8 position terminal; PARTNUM: MPT-08-01-01-L-RA-LC
J14 = avc:IPL1-1XX-02-XXX-DH-K-XX-MKT: Terminal Header 2x10 Right Angle; PARTNUM: IPL1-110-01-L-D-RA-K
J15 J26-J52 J58-J71 J73-J78 J81-J95 = aAcroname:BOARD00012: Jumper for shorting connections 0.1 inch spacing; ACRONAME: -; PARTNUM: -
J16 J17 = aAcroname:TSW1X20: 0.1 inch 1x20 header; ACRONAME: -; PARTNUM: ?; UNITCOST: ?
J18-J25 J54 = aAcroname:BOARD00003: Through hole for 22AWG wire; ACRONAME: -; NOTES: No Stuff; PARTNUM: -
J55-J57 = avc:SENSOR_INTERFACE: Generalized Sensor Interface; PARTNUM: -
J72 = avc:GPS15X: Garmin GPS OEM; PARTNUM: 010-00240-21
J96 J97 = aAcroname:BOARD00008: Through hole for 12AWG wire.
L1 = avc:7447709004: INDUCTOR POWER 4.7UH 9.3A; PARTNUM: 7447709004
L2 = aAcroname:PMISC00013: FERRITE CHIP SIGNAL 30 OHM 500mA 0402; ACRONAME: PMISC00013; PARTNUM: LI0402E300R-10; UNITCOST: 0.05
Q1-Q3 Q6 = aAcroname:IXTA52P10P: MOSFET P-CH 100V 52A; ACRONAME: PMISC00034; PARTNUM: IXTA52P10P; UNITCOST: 2.65
Q4 Q5 = aAcroname:SI4322DY: MOSFET N-Channel 30V w/ Schottky; ACRONAME: PMISC00036; PARTNUM: SI4322DY; UNITCOST: 0.95
R1 R6 R8 R12 = aAcroname:ERJ-3EKF1780V: 178 OHM 1/10W 1%; ACRONAME: PRESI00036; PARTNUM: ERJ-3EKF1780V
R2 R7 R9 R13 = aAcroname:ERJ-3EKF3830V: 383 OHM 1/10W 1%; ACRONAME: -; PARTNUM: ERJ-3EKF3830V
R3 R17 = aAcroname:ERJ-3EKF1004V: 1.0M OHM 1/10W +/-1%; ACRONAME: PRESI00046; PARTNUM: ERJ-3EKF1004V; UNITCOST: 0.007
R4 R22 = aAcroname:PRESI00005: 10.0K OHM 1/10W +/-1%; ACRONAME: PRESI00005; PARTNUM: ERJ-3EKF1002V; UNITCOST: 0.01
R5 = aAcroname:ERJ-2RKF9101X: 9.1K OHM 1/10W 0402; ACRONAME: -; PARTNUM: ERJ-2RKF9101X; RESISTANCE: 9.1kÛ,1%; UNITCOST: 0.007
R10 = aAcroname:PRESI00018: 200K OHM 1/10W +/-1%
R11 = aAcroname:PRESI00041: 0.01 OHM 5.0W 1%; ACRONAME: PRESI00041; PARTNUM: WSR5R0100FEA
R14 R16 R18-R21 = aAcroname:PRESI00006: 1.0K OHM 1/10W +/-1%; ACRONAME: PRESI00006; PARTNUM: ERJ-3EKF1001V; UNITCOST: 0.006
R15 = aAcroname:ERJ-2RKF1021X: 1.02K OHM 1/10W 0402; ACRONAME: -; PARTNUM: ERJ-2RKF1021X; RESISTANCE: 1.02kÛ,1%; UNITCOST: 0.007
S1 S2 = aAcroname:PMISC00005: SPDT Slider Switch; ACRONAME: PMISC00005; PARTNUM: 1101M2S3AQE2; UNITCOST: 1.81
S3 = aAcroname:EVQ-PE104K: SWITCH LT TOUCH 6X3.5 100GF SMD; ACRONAME: PMISC00029; PARTNUM: EVQ-PE104K; UNITCOST: 0.5129
U1-U3 U5 = aAcroname:LM1084IS-ADJ: 5A Low Drop Out Adjustable Voltage Regulator; ACRONAME: PCHIP00038; PARTNUM: LM1084IS-ADJ/NOPB
U4 = aAcroname:PCHIP00026: High Side Current Shunt Monitor (2.7V to 60.0V); ACRONAME: PCHIP00026; ALTERNATIVE: INA138NA/250; PARTNUM: INA168NA/250
U6 = avc:LM3150: Simple Switcher Controller 42V Synchronous Step-Down; ACRONAME: -; PARTNUM: LM3150
U7 = avc:AR6115: Spektrum AR6115 receiver; PARTNUM: AR6115
U8 = avc:L7912CD2T-TR: -12 V LDO Regulator; PARTNUM: L7912CD2T-TR; VOLTAGE: -12.0 V
U9 = avc:L3G4200DTR: IC GYROSCOPE MEMS 3AXIS; PARTNUM: L3G4200DTR
U10 = aAcroname:ADS7828E: 12-Bit, 8-Channel Sampling Analog-to-Digital Converter with I2C Interface; ACRONAME: PCHIP00039; PARTNUM: ADS7828E/250
U11 = avc:CMPS10: Devantech CMPS10; PARTNUM: CMPS10
U12 = avc:ADXL335: Small low power 3-axis analog output acccelerometer; ALTERNATIVE: ADXL325; PARTNUM: ADXL335

## Board
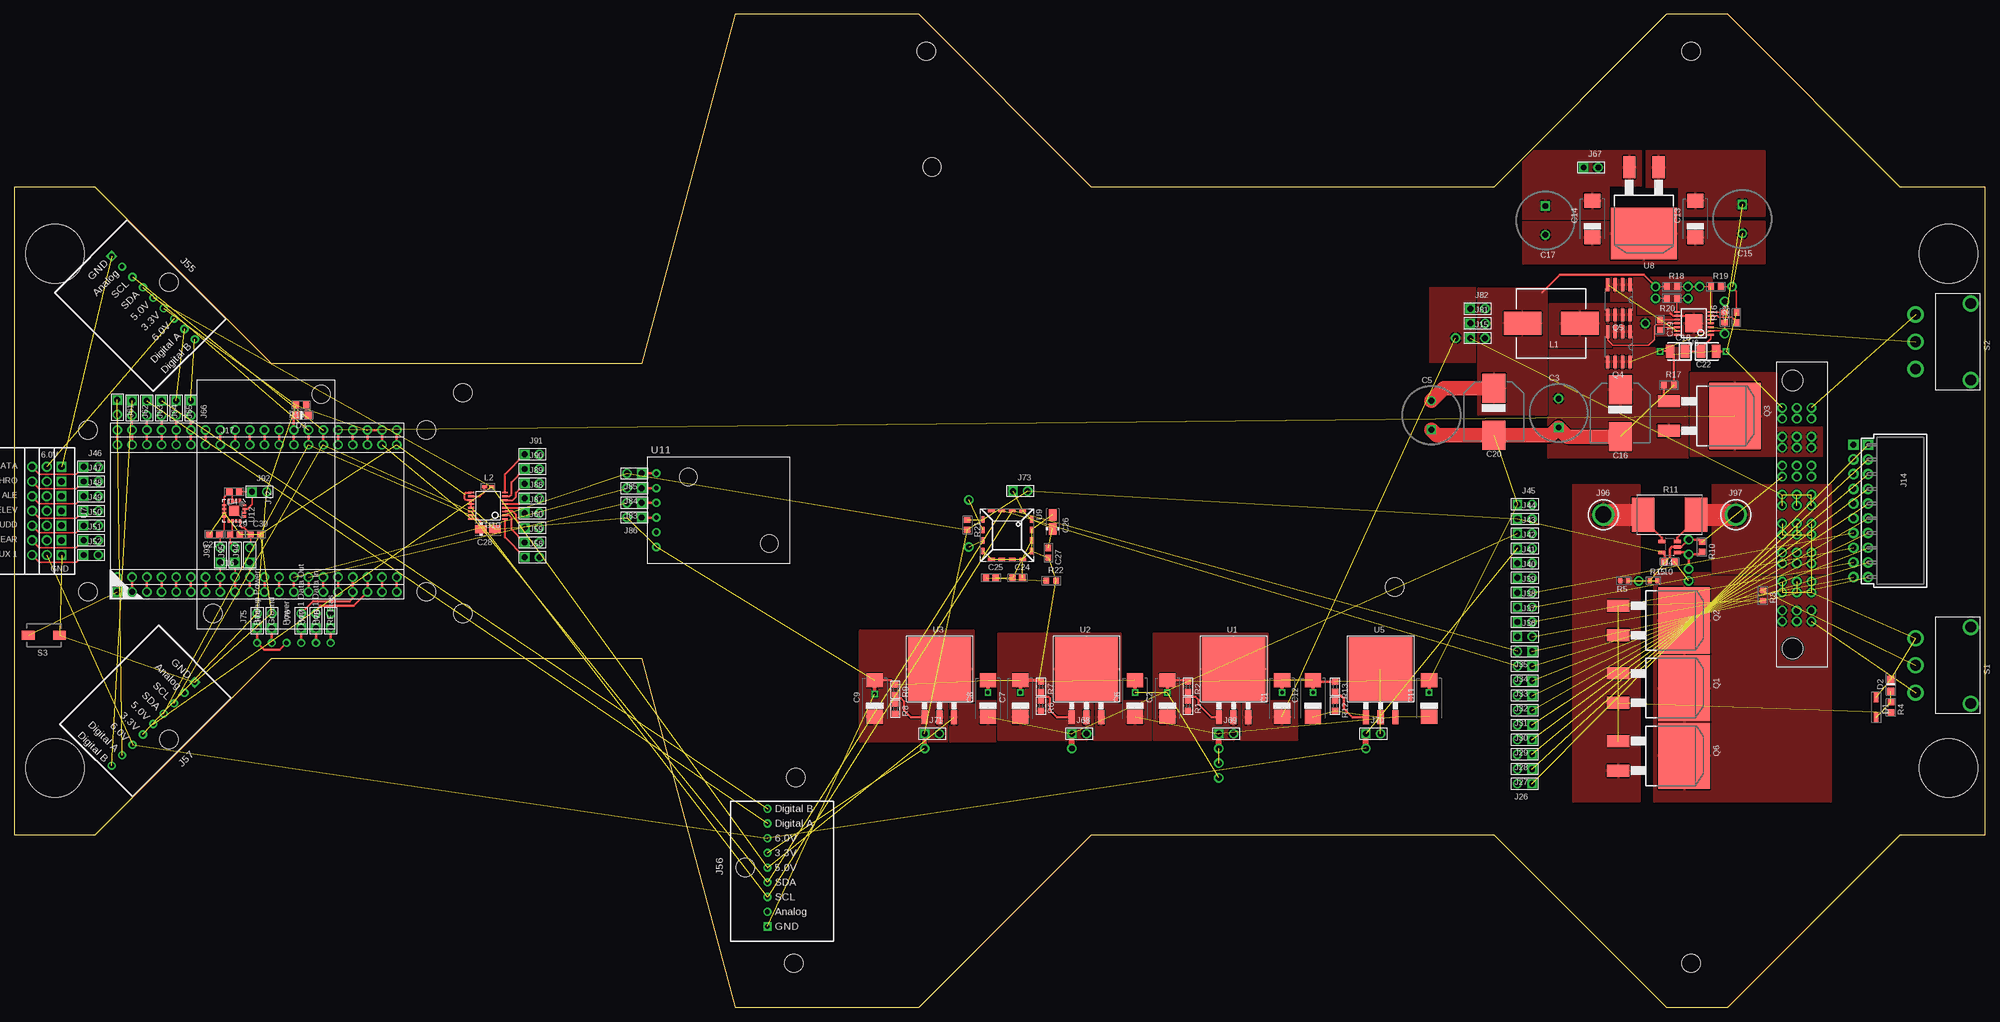
[diagram p6: board, top side]
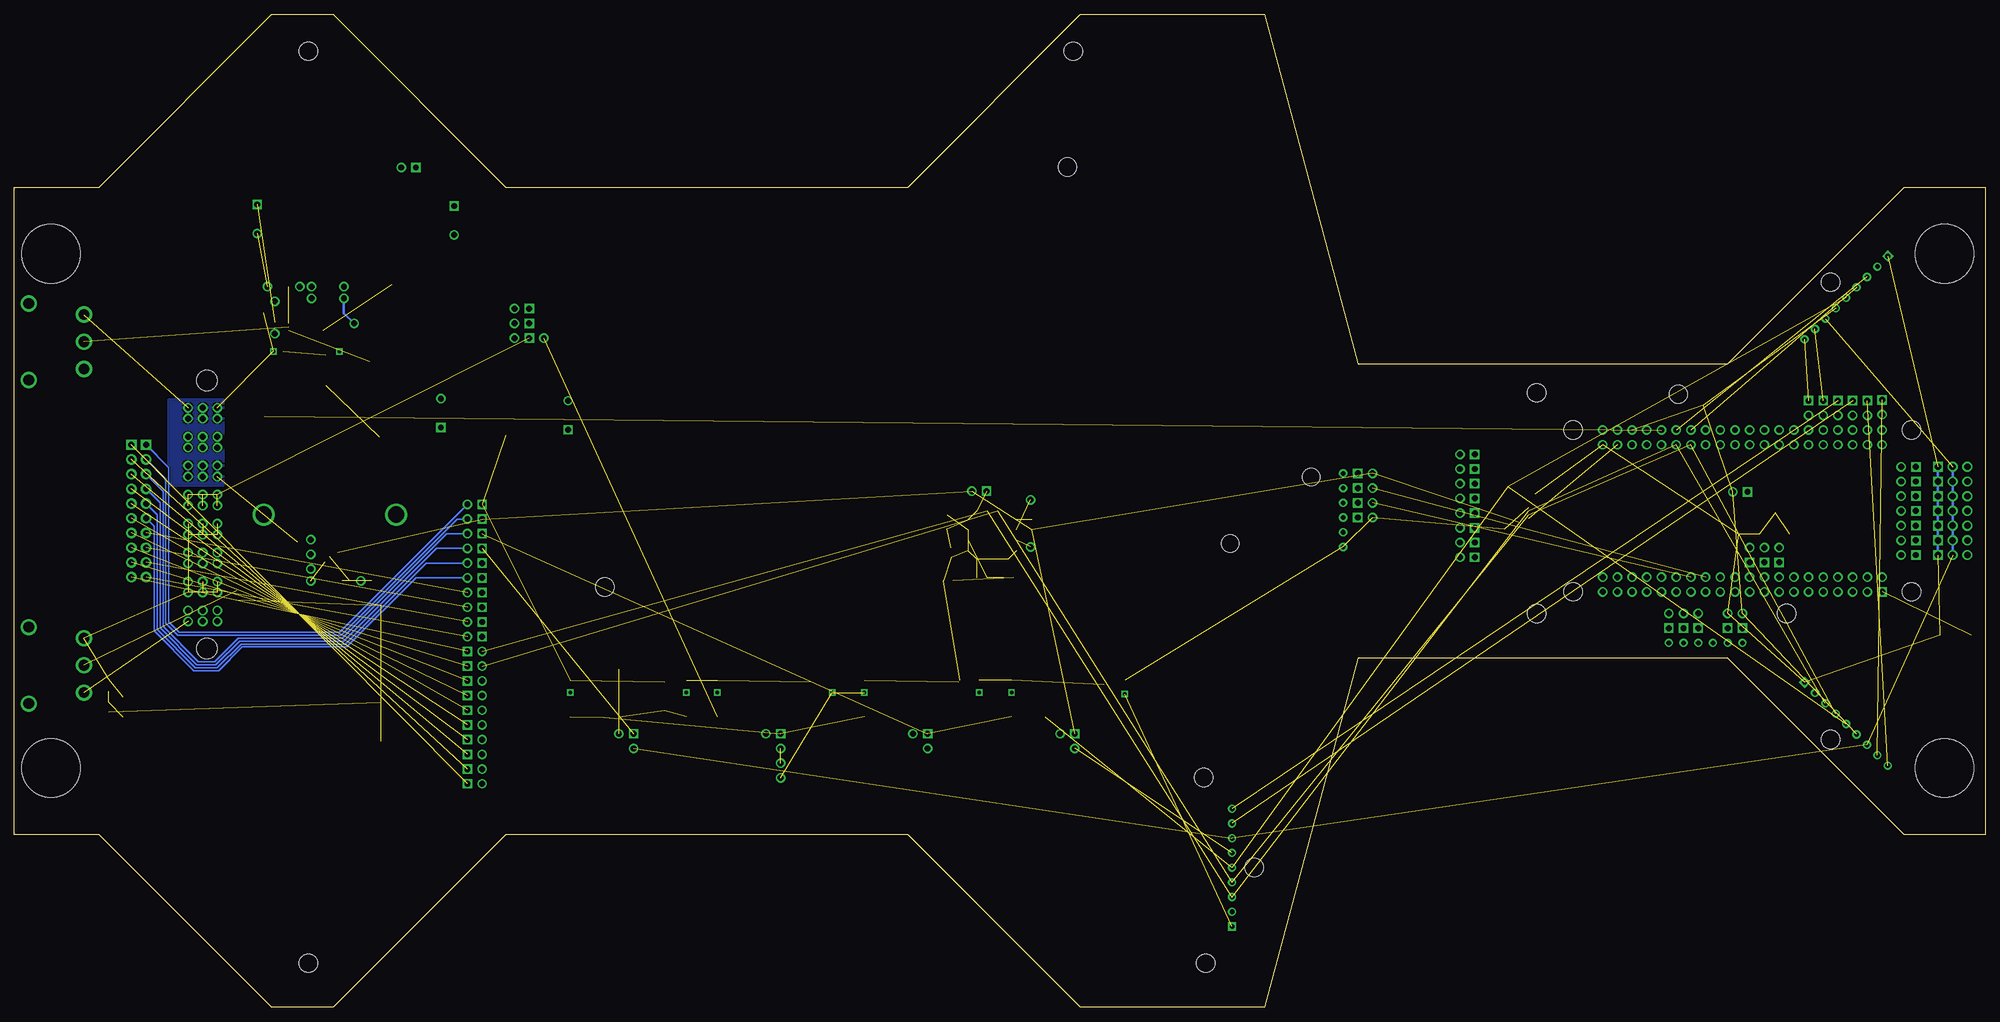
[diagram p7: board, bottom side, seen from below]

Size 340.36 x 171.45 mm. Coordinates in mm from the lower left corner, seen from the top.
Outline: 325.75,29.84 340.36,29.84 340.36,141.6 325.75,141.6 295.91,171.45 285.36,171.45 255.51,141.6 186.06,141.6 156.21,171.45 124.46,171.45 108.3,111.12 44.45,111.12 13.97,141.6 0,141.6 0,29.84 13.97,29.84 44.45,60.33 108.3,60.33 124.46,0 156.21,0 186.06,29.84 255.51,29.84 285.36,0 295.91,0 325.75,29.84
Copper layers (1+16): Top 0.0356mm / dielectric 0.2261mm / Bottom 0.0356mm
Design rules "advanced_2lay": minimum track width 7mil, minimum drill 5mil, track to track 7mil, track to pad 7mil, pad to pad 7mil, via to via 7mil, smd to smd 7mil, copper to edge 10mil, drill to drill 8mil, minimum pad ring 12mil, minimum via ring 10mil, stop-mask expansion 4mil, vias tented up to drill 20mil, thermal gap 10mil
Holes 10.16 mm at 7.01,130.12 7.01,41.33 334.04,130.12 334.04,41.33
Holes 3.2 mm at 289.56,7.62 238.38,72.59 134.62,7.62 134.98,39.7 12.7,99.69 12.7,71.75 71.12,99.69 71.12,71.75 157.48,165.1 158.47,145.11 289.56,165.1 77.47,68.02 77.47,106.12

### Footprints (pad centres in the part's own frame; a part is rotated, then mirrored left to right if it is on the bottom)
SMC_D = smd 2.4 x 2.8: + -3.15,0; - 3.15,0
PANASONIC_NHG_A = drill 1 round: + 0,2.5 | drill 1 square: - 0,-2.5
C0603 = smd 1.1 x 1: 1 -0.85,0; 2 0.85,0
PANASONIC_G = smd 4 x 5: + 0,-4.05; - 0,4.05
T491 = smd 1.5 x 2.3: + 1.3,0; - -1.3,0
SMC_A = smd 2 x 1.35: + 1.2,0; - -1.2,0
SOD123 = smd 1.6 x 0.8: A 1.7,0; C -1.7,0
CHIPLED_0805 = smd 1.2 x 1.2: A 0,-1.05; C 0,1.05
TSW1X1_VAL = drill 1.02 round: P$1 0,0
BRAINSTEMSOCKET = drill 1.02 round: 3.3V 46.99,29.21; A2D0 19.05,1.27; A2D1 21.59,1.27; A2D2 24.13,1.27; DAC 16.51,1.27; DIO0 1.27,29.21; DIO1 3.81,29.21; DIO2 6.35,29.21; DIO3 8.89,29.21; DIO4 11.43,29.21; DIO5 13.97,29.21; DIO6 16.51,29.21; DIO7 19.05,29.21; DIO8 21.59,29.21; DIO9 24.13,29.21; DIO10/SDA1 26.67,29.21; DIO11/SCL1 29.21,29.21; GND 49.53,29.21; PE_0 3.81,1.27; PE_1 6.35,1.27; PE_2 8.89,1.27; PE_3 11.43,1.27; PE_4 13.97,1.27; RTCV 44.45,29.21; SCL 36.83,29.21; SDA 34.29,29.21; T0 46.99,1.27; T1 49.53,1.27; UART0_RX 41.91,1.27; UART0_RX_LED 36.83,1.27; UART0_TX 44.45,1.27; UART0_TX_LED 39.37,1.27; UART1_RX 31.75,1.27; UART1_RX_LED 26.67,1.27; UART1_TX 34.29,1.27; UART1_TX_LED 29.21,1.27; UNREGULATEDM 39.37,29.21; VUNREGULATED 41.91,29.21; WATCHDOG 31.75,29.21 | drill 1.02 square: !RESET 1.27,1.27
MPT-08-XX-X-RA-XX = drill 1.04 round: 1@0 -18.44,-3.3; 1@1 -18.44,-0.76; 1@2 -18.44,1.78; 1@3 -16.56,-3.3; 1@4 -16.56,-0.76; 1@5 -16.56,1.78; 2@0 -13.44,-3.3; 2@1 -13.44,-0.76; 2@2 -13.44,1.78; 2@3 -11.56,-3.3; 2@4 -11.56,-0.76; 2@5 -11.56,1.78; 3@0 -8.44,-3.3; 3@1 -8.44,-0.76; 3@2 -8.44,1.78; 3@3 -6.56,-3.3; 3@4 -6.56,-0.76; 3@5 -6.56,1.78; 4@0 -3.44,-3.3; 4@1 -3.44,-0.76; 4@2 -3.44,1.78; 4@3 -1.56,-3.3; 4@4 -1.56,-0.76; 4@5 -1.56,1.78; 5@0 1.56,-3.3; 5@1 1.56,-0.76; 5@2 1.56,1.78; 5@3 3.44,-3.3; 5@4 3.44,-0.76; 5@5 3.44,1.78; 6@0 6.56,-3.3; 6@1 6.56,-0.76; 6@2 6.56,1.78; 6@3 8.44,-3.3; 6@4 8.44,-0.76; 6@5 8.44,1.78; 7@0 11.56,-3.3; 7@1 11.56,-0.76; 7@2 11.56,1.78; 7@3 13.44,-3.3; 7@4 13.44,-0.76; 7@5 13.44,1.78; 8@0 16.56,-3.3; 8@1 16.56,-0.76; 8@2 16.56,1.78; 8@3 18.44,-3.3; 8@4 18.44,-0.76; 8@5 18.44,1.78 | hole 3.56: -23.14,0; 23.14,0
IPL1-110-01-S-RA = drill 1.016 pad 1.778 square: 1 0,0; 11 0,-2.54 | drill 1.016 pad 1.778 round: 2 2.54,0; 3 5.08,0; 4 7.62,0; 5 10.16,0; 6 12.7,0; 7 15.24,0; 8 17.78,0; 9 20.32,0; 10 22.86,0; 12 2.54,-2.54; 13 5.08,-2.54; 14 7.62,-2.54; 15 10.16,-2.54; 16 12.7,-2.54; 17 15.24,-2.54; 18 17.78,-2.54; 19 20.32,-2.54; 20 22.86,-2.54
TSW1X2 = drill 1.02 square: P$1 -1.27,0 | drill 1.02 round: P$2 1.27,0
TSW1X20 = drill 1.02 round: P$1 -22.86,0; P$2 -20.32,0; P$3 -17.78,0; P$4 -15.24,0; P$5 -12.7,0; P$6 -10.16,0; P$7 -7.62,0; P$8 -5.08,0; P$9 -2.54,0; P$10 0,0; P$11 2.54,0; P$12 5.08,0; P$13 7.62,0; P$14 10.16,0; P$15 12.7,0; P$16 15.24,0; P$17 17.78,0; P$18 20.32,0; P$19 22.86,0; P$20 25.4,0
TSW1X1 = drill 1.02 round: P$1 0,0
SENSOR_INTERFACE = drill 0.8 round: 3.3V 3.81,2.54; 5.0V 3.81,0; 6.0V 3.81,5.08; ANALOG 3.81,-7.62; DA 3.81,7.62; DB 3.81,10.16; SCL 3.81,-5.08; SDA 3.81,-2.54 | drill 0.8 square: GND 3.81,-10.16 | hole 3.2: 0,0
GPS15 = drill 0.8 round: BACKUPPWR 7.62,-5.08; GND 10.16,-5.08; PWR 12.7,-5.08; RFBIAS 20.32,-5.08; SRX 17.78,-5.08; STX 15.24,-5.08 | hole 3.2: 0,0; 18.67,37.85
TSW1X1_12AWG = drill 2.8 round: P$1 0,0
7447709004 = smd 6.5 x 4: 1 -4.95,0; 2 4.95,0
L0402 = smd 0.889 x 0.559: 1 -0.603,0; 2 0.603,0
D2PACK = smd 11.43 x 8.89: D 0,2.54 | smd 2.083 x 3.81: G -2.54,-8.89; S 2.54,-8.89
SO-08 = smd 0.6 x 2.2: 1 -1.905,-2.6; 2 -0.635,-2.6; 3 0.635,-2.6; 4 1.905,-2.6; 5 1.905,2.6; 6 0.635,2.6; 7 -0.635,2.6; 8 -1.905,2.6
R0603@1 = smd 1 x 1.1: 1 -0.85,0; 2 0.85,0
R0603 = smd 1 x 1.1: 1 -0.85,0; 2 0.85,0
R0402 = smd 0.7 x 0.9: 1 -0.65,0; 2 0.65,0
R4527 = smd 3.94 x 5.84: 1 -4.575,0; 2 4.575,0
SPDTRA = drill 1.854 round: 1 4.699,4.763; 2 0,4.763; 3 -4.699,4.763; 4 6.604,-4.763; 5 -6.604,-4.763
SPST-NO = smd 2.2 x 1.6: P$1 -2.7,0; P$2 2.7,0
TO263-3 = smd 1.067 x 2.413: 1 -2.54,-5.791; 2 0,-5.791; 3 2.54,-5.791 | smd 10.922 x 10.922: TAB 0,2.54
SOT23-5 = smd 0.6 x 1.2: 1 -0.95,-1.306; 2 0,-1.306; 3 0.95,-1.306; 4 0.95,1.306; 5 -0.95,1.306
TSSOP14EXP = smd 0.305 x 0.991: 1 -1.95,-2.918; 2 -1.3,-2.918; 3 -0.65,-2.918; 4 0,-2.918; 5 0.65,-2.918; 6 1.3,-2.918; 7 1.95,-2.918; 8 1.95,2.918; 9 1.3,2.918; 10 0.65,2.918; 11 0,2.918; 12 -0.65,2.918; 13 -1.3,2.918; 14 -1.95,2.918 | smd 3.1 x 3: PAD 0,0
AR6115 = drill 1.1 round: ALE 2.54,5.08; AUX1 -7.62,5.08; BIND 7.62,5.08; ELEV 0,5.08; GEAR -5.08,5.08; RUDD -2.54,5.08; THRO 5.08,5.08; VCC@1 -7.62,2.54; VCC@2 -5.08,2.54; VCC@3 -2.54,2.54; VCC@4 0,2.54; VCC@5 2.54,2.54; VCC@6 5.08,2.54; VCC@7 7.62,2.54 | drill 1.1 square: GND@1 -7.62,0; GND@2 -5.08,0; GND@3 -2.54,0; GND@4 0,0; GND@5 2.54,0; GND@6 5.08,0; GND@7 7.62,0
LGA16 = smd 0.5 x 1.127: 1 -4.186,2.696; 2 -4.187,0.898; 3 -4.187,-0.898; 4 -4.187,-2.696; 9 4.186,-2.696; 10 4.187,-0.898; 11 4.187,0.898; 12 4.187,2.696 | smd 1.127 x 0.5: 5 -2.696,-4.186; 6 -0.898,-4.187; 7 0.898,-4.187; 8 2.696,-4.187; 13 2.696,4.186; 14 0.898,4.187; 15 -0.898,4.187; 16 -2.696,4.187
TSSOP16 = smd 0.305 x 0.991: 1 -2.275,-2.918; 2 -1.625,-2.918; 3 -0.975,-2.918; 4 -0.325,-2.918; 5 0.325,-2.918; 6 0.975,-2.918; 7 1.625,-2.918; 8 2.275,-2.918; 9 2.275,2.918; 10 1.625,2.918; 11 0.975,2.918; 12 0.325,2.918; 13 -0.325,2.918; 14 -0.975,2.918; 15 -1.625,2.918; 16 -2.275,2.918
CMPS10 = drill 0.8 round: 3.3V 0,6.35; FACTORY 0,-3.81; GND 0,-6.35; MODE 0,-1.27; RX 0,1.27; TX 0,3.81 | hole 3.05: 5.5,5.75; 19.5,-5.75
LFCSP-16 = smd 1.75 x 1.75: 0 0,0 | smd 0.65 x 0.37: 1 -1.75,0.975; 2 -1.75,0.325; 3 -1.75,-0.325; 4 -1.75,-0.975; 9 1.75,-0.975; 10 1.75,-0.325; 11 1.75,0.325; 12 1.75,0.975 | smd 0.37 x 0.65: 5 -0.975,-1.75; 6 -0.325,-1.75; 7 0.325,-1.75; 8 0.975,-1.75; 13 0.975,1.75; 14 0.325,1.75; 15 -0.325,1.75; 16 -0.975,1.75

### Placement (x,y rotation side)
C1  218.95,53.34 90 top
C2  199.14,53.34 90 top
C3  266.7,102.62 0 top
C4  37.97,89.03 180 top
C5  244.73,102.23 0 top
C6  193.55,53.34 90 top
C7  173.74,53.34 90 top
C8  168.15,53.34 90 top
C9  148.59,53.34 90 top
C10  285.88,76.96 180 top
C11  244.35,53.34 90 top
C12  224.28,53.34 90 top
C13  290.32,136.14 90 top
C14  272.54,136.14 90 top
C15  298.45,136.14 180 top
C16  277.37,102.62 180 top
C17  264.41,135.89 180 top
C18  287.27,113.28 0 top
C19  284.23,117.86 270 top
C20  255.52,102.87 180 top
C21  34.54,81.66 180 top
C22  292.61,113.28 180 top
C23  297.43,119.13 90 top
C24  173.23,74.17 0 top
C25  168.66,74.17 0 top
C26  179.32,83.82 270 top
C27  178.56,78.49 270 top
C28  81.79,82.55 180 top
C29  38.1,81.66 0 top
C30  41.66,81.66 0 top
D1  321.56,51.82 270 top
D2  324.1,55.63 0 top
D3  49.66,102.23 90 top
J1  248.92,115.57 90 top
J2  208.03,44.7 0 top
J3  280.54,73.66 90 top
J4  182.63,44.7 0 top
J5  157.23,44.7 0 top
J6  16.51,70.48 0 top
J7  289.18,78.23 270 top
J8  289.18,80.77 0 top
J9  289.18,73.66 0 top
J10  208.03,42.16 0 top
J11  208.03,39.62 0 top
J12  233.43,44.7 180 top
J13  307.09,85.09 90 top
J14  320.17,97.16 270 top
J15  252.73,115.57 0 top
J16  40.64,74.3 0 top
J17  40.64,97.16 0 top
J18  289.05,122.43 90 top
J19  283.46,122.43 0 top
J20  295.4,121.92 270 top
J21  295.4,116.33 270 top
J22  283.46,124.46 270 top
J23  291.08,124.46 270 top
J24  289.05,124.46 270 top
J25  296.67,124.46 270 top
J26  260.86,38.61 180 top
J27  260.86,41.15 180 top
J28  260.86,43.69 180 top
J29  260.86,46.23 180 top
J30  260.86,48.77 180 top
J31  260.86,51.31 180 top
J32  260.86,53.85 180 top
J33  260.86,56.39 180 top
J34  260.86,58.93 180 top
J35  260.86,61.47 180 top
J36  260.86,64.01 0 top
J37  260.86,66.55 0 top
J38  260.86,69.09 0 top
J39  260.86,71.63 0 top
J40  260.86,74.17 0 top
J41  260.86,76.71 0 top
J42  260.86,79.25 0 top
J43  260.86,81.79 0 top
J44  260.86,84.33 0 top
J45  260.86,86.87 0 top
J46  13.21,93.34 0 top
J47  13.21,90.81 0 top
J48  13.21,88.27 0 top
J49  13.21,85.72 0 top
J50  13.21,83.19 0 top
J51  13.21,80.64 0 top
J52  13.21,78.11 0 top
J53  289.18,75.69 0 top
J54  281.69,118.11 0 top
J55  26.67,125.22 225 top
J56  126.24,24.13 0 top
J57  26.67,46.23 135 top
J58  89.41,77.72 0 top
J59  89.41,80.26 0 top
J60  89.41,82.8 0 top
J61  17.78,103.63 270 top
J62  20.32,103.5 270 top
J63  22.86,103.5 270 top
J64  25.4,103.5 270 top
J65  27.94,103.5 270 top
J66  30.48,103.5 270 top
J67  272.29,145.03 0 top
J68  183.9,47.24 0 top
J69  209.3,47.24 0 top
J70  234.7,47.24 0 top
J71  158.5,47.24 0 top
J72  34.29,68.02 0 top
J73  173.74,89.15 0 top
J74  44.45,66.75 90 top
J75  41.91,66.75 90 top
J76  49.53,66.75 90 top
J77  52.07,66.75 90 top
J78  54.61,66.75 90 top
J79  164.85,87.63 270 top
J80  164.85,79.5 270 top
J81  252.73,118.11 0 top
J82  252.73,120.65 0 top
J83  107.06,87.12 180 top
J84  107.06,89.66 180 top
J85  107.06,92.2 180 top
J86  107.06,84.58 180 top
J87  89.41,85.34 0 top
J88  89.41,87.88 0 top
J89  89.41,90.42 0 top
J90  89.41,92.96 0 top
J91  89.41,95.5 0 top
J92  42.29,89.03 0 top
J93  35.56,78.11 90 top
J94  40.64,78.11 90 top
J95  38.1,78.11 90 top
J96  274.45,85.09 0 top
J97  297.31,85.09 0 top
L1  265.43,118.11 180 top
L2  81.79,89.92 0 top
Q1  285.88,55.12 270 top
Q2  285.88,66.8 270 top
Q3  294.64,102.11 270 top
Q4  277.11,114.05 180 top
Q5  277.11,122.17 180 top
Q6  285.88,43.43 270 top
R1  202.69,52.07 270 top
R2  202.69,55.37 270 top
R3  302.01,71.12 270 top
R4  324.1,51.82 270 top
R5  278,73.66 180 top
R6  177.29,52.07 270 top
R7  177.29,55.37 270 top
R8  152.15,51.56 270 top
R9  152.15,54.86 270 top
R10  291.46,79.5 270 top
R11  285.88,85.09 0 top
R12  228.09,52.07 270 top
R13  228.09,55.37 270 top
R14  49.53,104.01 180 top
R15  283.08,73.66 0 top
R16  295.4,119.13 90 top
R17  285.75,107.44 0 top
R18  286.26,124.46 0 top
R19  293.88,124.46 0 top
R20  286.26,122.43 180 top
R21  164.59,83.31 270 top
R22  179.07,73.66 0 top
S1  333.12,59.05 90 top
S2  333.12,114.94 90 top
S3  5.08,64.26 180 top
U1  210.57,55.88 0 top
U2  185.17,55.88 0 top
U3  159.77,55.88 0 top
U4  285.88,79.5 90 top
U5  235.97,55.88 0 top
U6  290.07,118.11 90 top
U7  8.13,85.72 90 top
U8  281.43,136.14 180 top
U9  171.45,81.53 270 top
U10  81.79,86.61 90 top
U11  110.87,85.85 0 top
U12  37.97,85.72 270 top

### Tracks (layer width: path | path; a pad name or v marks a point on that pad's centre or on a via)
3V3  (13 unrouted)
  Top 0.305: U10.16 80,84.34 80.59,83.75 C28.+
  Top 0.406: J17.P$18 J6.RTCV J6.3.3V J17.P$19 | U4.5 285.03,78.1 C10.2
  Top 0.813: J5.P$1 J71.P$1
5V0  (6 unrouted)
  Top 1.016: J4.P$1 J68.P$1
  pour Top (rank 2): 161.54,45.97 161.54,52.83 170.18,52.83 170.18,45.97
6V0  (5 unrouted)
  Top 1.016: J12.P$1 J70.P$1
  Bottom 0.406: U7.VCC@1 U7.VCC@2 U7.VCC@3 U7.VCC@4 U7.VCC@5 U7.VCC@6 U7.VCC@7
9.0V  (4 unrouted)
  Top 1.016: J2.P$1 J69.P$1
  pour Top (rank 2): 186.44,46.23 186.44,52.83 196.6,52.83 196.6,46.23
12.0V  (7 unrouted)
  pour Top (rank 2): 211.84,52.83 221.49,52.83 221.49,46.23 211.84,46.23
  pour Top (rank 2): 252.48,124.21 252.48,111.51 244.6,111.51 244.6,124.21
!RESET  (1 unrouted)
  Top 0.406: J6.!RESET J16.P$1
A2D0
  Top 0.254: J16.P$8 J93.P$1
  Top 0.406: J6.A2D0 J16.P$8
A2D1
  Top 0.254: J16.P$9 J95.P$1
  Top 0.406: J6.A2D1 J16.P$9
A2D2
  Top 0.254: J16.P$10 J94.P$1
  Top 0.406: J6.A2D2 J16.P$10
BATTERY_MOTOR+_IN  (1 unrouted)
  pour Top (rank 2): 283.21,74.93 313.69,74.93 313.69,35.56 283.21,35.56
BATTERY_MOTOR+_OUT
  Top 0.406: U4.3 287.18,81.06 290.45,84.33 R11.2
  Top 3.81: R11.2 J97.P$1
  pour Top: 293.37,90.17 313.69,90.17 313.69,74.93 293.37,74.93
BATTERY_MOTOR+_OUT_PRE  (1 unrouted)
  Top 0.406: U4.4 284.57,81.06 281.3,84.33 R11.1
  Top 3.81: J96.P$1 R11.1
  pour Top: 280.67,90.17 280.67,35.56 269.24,35.56 269.24,90.17
DIO0
  Top 0.254: J6.DIO0 J61.P$2
  Top 0.406: J17.P$1 J6.DIO0
DIO1
  Top 0.254: J6.DIO1 J62.P$2
  Top 0.406: J17.P$2 J6.DIO1
DIO2
  Top 0.406: J17.P$3 J6.DIO2 J63.P$2
DIO3
  Top 0.406: J17.P$4 J6.DIO3 J64.P$2
DIO4
  Top 0.406: J17.P$5 J6.DIO4 J65.P$2
DIO5
  Top 0.406: J17.P$6 J6.DIO5 J66.P$2
DIO6
  Top 0.406: J17.P$7 J6.DIO6
DIO7
  Top 0.406: J17.P$8 J6.DIO7
DIO8
  Top 0.406: J17.P$9 J6.DIO8
DIO9
  Top 0.406: J17.P$10 J6.DIO9
DIO10
  Top 0.406: J17.P$11 J6.DIO10/SDA1
DIO11
  Top 0.406: J17.P$12 J6.DIO11/SCL1
GND  (via drill 0.6)  (45 unrouted)
  Top 0.254: R19.2 J25.P$1 297.43,123.7 C23.2 | U12.7 U12.6 U12.5 36.22,88.13 C4.2 37.65,88.5 U12.3
  Top 0.305: U10.9 77.97,88.89 77.72,88.65 77.72,87.88 78.02,87.59 U10.11 U10.12 U10.13 | C22.- v295.66,113.28 | C18.- v284.23,113.28
  Top 0.406: J17.P$20 J6.GND | R2.1 202.42,56.49 C2.- | R13.1 224.55,56.22 C12.- | R9.1 151.37,56.49 C9.- | R17.2 286.6,112.66 C18.- | R10.1 291.05,80.77 J8.P$1 287.91,79.5 U4.2 286.26,79.5 285.88,79.12 285.88,77.81 C10.1
  Top 0.61: C2.- v199.14,54.36 | v218.95,54.36 C1.- | v173.74,54.36 C7.- 177.02,56.49 R7.1 | v193.55,54.36 C6.- | v224.28,54.36 C12.- | v244.35,54.36 C11.- | v148.59,54.1 C9.- | v168.15,54.36 C8.-
  Top 2.54: C5.- 245.64,98.82 C20.- 265.4,98.82 C3.- 268.25,98.57 C16.-
  Bottom 0.406: U7.GND@1 U7.GND@2 U7.GND@3 U7.GND@4 U7.GND@5 U7.GND@6 U7.GND@7
  pour Bottom: 304.29,90.17 313.69,90.17 313.69,104.9 304.29,104.9
  pour Top (rank 3): 260.6,135.64 302.26,135.64 302.26,128.52 260.6,128.52
GND3  (14 unrouted)
IMOTOR_A2D
  Top 0.406: J7.P$1 288.86,78.55 U4.1 | R10.2 291.05,78.23 J7.P$1 | J53.P$1 J7.P$1
N$1
  Top 0.406: R2.2 202.69,53.59 | 202.69,53.59 R1.1 | U1.1 206.71,50.09 204.47,52.32 204.47,53.09 203.96,53.59 202.69,53.59
N$2  (1 unrouted)
N$3  (3 unrouted)
N$4  (2 unrouted)
N$5  (1 unrouted)
N$6
  Top 0.406: U2.1 180.03,50.09 178.82,51.31 178.82,53.34 178.56,53.59 177.29,53.59 | 177.29,53.59 R7.2 | R6.1 177.29,53.59
N$7
  Top 0.406: R8.1 152.15,53.34 | 152.15,53.34 R9.2 | 152.15,53.34 153.16,53.34 153.67,52.83 153.67,51.31 154.89,50.09 U3.1
N$8
  Top 0.406: U5.1 231.09,50.09 229.62,51.56 229.62,53.34 229.11,53.85 228.35,53.85 | 228.35,53.85 228.09,53.85 | R12.1 228.09,53.59 228.35,53.85 | R13.2 228.09,54.1 228.35,53.85
N$9
  Top 0.406: D3.A 50.38,102.56 R14.1
N$12
  Top 0.406: J17.P$13 J6.WATCHDOG 48.26,101.89 D3.C
N$16
  Top 0.406: J6.PE_0 J16.P$2
N$17
  Top 0.406: J6.PE_1 J16.P$3
N$18
  Top 0.406: J6.PE_2 J16.P$4
N$19
  Top 0.406: J6.PE_3 J16.P$5
N$20
  Top 0.406: J6.PE_4 J16.P$6
N$21
  Top 0.406: J6.DAC J16.P$7
N$22
  Top 0.406: J6.UART1_RX_LED J16.P$11
N$23
  Top 0.406: J6.UART1_TX_LED J16.P$12
N$24
  Top 0.406: J86.P$1 U11.MODE
N$25
  Top 0.305: U10.1 84.71,81.16 J58.P$1
N$26
  Top 0.406: J6.UART0_RX_LED J16.P$15
N$27
  Top 0.406: J6.UART0_TX_LED J16.P$16
N$28  (4 unrouted)
N$29  (1 unrouted)
N$30
  Top 0.406: J6.T0 J16.P$19
N$31
  Top 0.406: J6.T1 J16.P$20
N$32
  Top 0.406: J75.P$1 J72.BACKUPPWR 43.13,61.72 45.77,61.72 J72.PWR
N$33
  Top 0.406: J72.GND J74.P$1
N$34
  Top 0.406: J72.STX J76.P$1
N$35
  Top 0.406: J72.SRX J77.P$1
N$36
  Top 0.406: J72.RFBIAS J78.P$1
N$37  (2 unrouted)
N$38  (1 unrouted)
N$39  (1 unrouted)
N$40  (1 unrouted)
N$41
  Top 0.305: U10.10 80.36,88.24 81.19,89.06 L2.1
N$42
  Top 0.254: J22.P$1 R18.1
  Top 0.406: J22.P$1 281.43,126.49 266.95,126.49 263.91,123.44
  Top 2.54: C20.+ 246.91,106.92 C5.+
  pour Top: 264.67,124.21 264.67,102.36 252.73,102.36 252.73,124.21
N$43
  Top 0.406: J85.P$1 U11.3.3V
N$44
  Top 0.406: J17.P$17 J6.VUNREGULATED
N$45
  Top 0.254: C18.+ C22.+ 291.59,113.57 291.59,114.05 292.99,115.44 U6.1
N$46  (1 unrouted)
N$47
  Top 0.305: U6.PAD 288.77,119.41 U6.9 286.48,119.41 286,119.89
  pour Top (rank 4): 275.84,125.98 293.12,125.98 293.12,116.08 275.84,116.08
N$48  (1 unrouted)
N$49
  Top 0.254: U6.11 285.5,118.11 285.24,117.86 283.46,117.86 283.21,117.6 283.21,115.32 282.19,114.3 276.1,114.3 275.21,115.19 Q4.4
N$50
  Top 0.406: R17.1 284.9,105.5 Q3.G
N$51
  Top 0.254: J20.P$1 R16.2 295.32,120.06 U6.7
N$52
  Top 0.254: U6.10 284.28,118.76 C19.1 | J19.P$1 R20.2
  Bottom 0.406: J19.P$1 283.46,119.89 J54.P$1
  pour Top (rank 2): 265.18,121.41 265.18,114.05 283.21,114.05 283.21,118.11 287.78,118.11 287.78,119.13 279.91,119.13 279.91,121.41
N$53
  Top 0.254: U6.12 284.68,117.46 C19.2
N$54  (1 unrouted)
  Top 0.254: R18.2 J24.P$1 J23.P$1 R19.1
N$55
  Top 0.254: U6.8 287.15,122.39 R20.1 J18.P$1
N$56  (1 unrouted)
N$57  (1 unrouted)
N$58
  Top 0.254: U6.6 294.1,119.41 294.39,119.13 296.58,119.13 C23.1
N$59  (1 unrouted)
N$60  (1 unrouted)
N$61  (1 unrouted)
N$62  (1 unrouted)
N$63  (1 unrouted)
N$64  (1 unrouted)
N$65  (1 unrouted)
N$68  (1 unrouted)
N$69  (1 unrouted)
N$70  (1 unrouted)
N$71  (1 unrouted)
N$72
  Bottom 0.254: J40.P$2 271.02,74.17 282.96,62.23 300.99,62.23 305.05,58.17 309.37,58.17 316.23,65.02 316.23,83.06 J14.16
N$73
  Bottom 0.254: J41.P$2 269.24,76.71 283.21,62.74 301.24,62.74 305.31,58.67 309.12,58.67 315.72,65.28 315.72,85.09 J14.15
N$74
  Bottom 0.254: J14.14 315.21,87.12 315.21,65.53 308.86,59.18 305.56,59.18 301.5,63.25 283.46,63.25 267.46,79.25 J42.P$2
N$75
  Bottom 0.254: J43.P$2 265.68,81.79 283.72,63.75 301.75,63.75 305.82,59.69 308.61,59.69 314.71,65.79 314.71,89.15 J14.13
N$76
  Bottom 0.254: J44.P$2 263.91,84.33 283.97,64.26 312.17,64.26 314.2,66.29 314.2,91.19 J14.12
N$77
  Bottom 0.254: J14.11 313.69,93.22 313.69,66.55 311.91,64.77 284.23,64.77 J45.P$2
N$78
  Top 0.254: J46.P$1 10.67,92.08 4.32,92.08 U7.BIND
N$79
  Top 0.254: U7.THRO 4.32,89.53 10.67,89.53 J47.P$1
N$80
  Top 0.254: J48.P$1 10.67,87 4.32,87 U7.ALE
N$81
  Top 0.254: U7.ELEV 4.32,84.45 10.67,84.45 J49.P$1
N$82
  Top 0.254: U7.RUDD 4.32,81.92 10.67,81.92 J50.P$1
N$83
  Top 0.254: U7.GEAR 4.32,79.38 10.67,79.38 J51.P$1
N$84
  Top 0.254: U7.AUX1 4.32,76.83 10.67,76.83 J52.P$1
N$85
  Top 0.406: J84.P$1 U11.TX
N$86
  Top 0.406: J83.P$1 U11.RX
N$87
  Top 0.305: U10.2 85.44,84.99 85.85,84.58 85.85,82.55 J59.P$1
N$88  (1 unrouted)
N$89  (1 unrouted)
N$90
  Top 0.305: U10.3 86.06,85.64 86.61,85.09 86.61,84.33 J60.P$1
N$91
  Top 0.305: U10.4 87.19,86.29 J87.P$1
N$92  (1 unrouted)
N$93  (1 unrouted)
N$94  (1 unrouted)
N$95  (1 unrouted)
N$96
  Top 0.305: U10.5 87.19,86.94 J88.P$1
N$97
  Top 0.305: U10.6 86.06,87.59 86.61,88.14 86.61,88.9 J89.P$1
N$98
  Top 0.305: U10.7 85.44,88.24 85.85,88.65 85.85,90.68 J90.P$1
N$99
  Top 0.305: U10.8 84.71,92.07 J91.P$1
N$100
  Top 0.254: U12.14 U12.15 40.2,86.05 41.02,86.87 J92.P$1 C4.1
N$101  (4 unrouted)
N$102
  pour Top: 280.92,141.99 275.34,141.99 275.34,136.14 260.6,136.14 260.6,147.83 280.92,147.83
N$103
  Top 0.254: J93.P$2 35.56,81.5 C21.1 36.22,82.49 U12.8
N$106
  pour Top: 169.93,64.52 169.93,46.23 186.18,46.23 186.18,52.83 191.01,52.83 191.01,64.52
N$107
  pour Top: 196.85,64.52 216.41,64.52 216.41,52.83 211.58,52.83 211.58,46.23 196.85,46.23
N$109
  pour Top: 161.04,45.97 161.04,52.83 165.61,52.83 165.61,65.02 146.05,65.02 146.05,45.97
N$110
  Top 0.254: J95.P$2 37.25,80.22 C29.1 37.65,82.06 U12.10
N$111
  Top 0.254: J94.P$2 40.81,79.54 C30.1 39.66,82.8 39.37,82.8 38.95,83.23 U12.12
POWER_LIPO+_IN  (1 unrouted)
  Top 0.406: J17.P$16 J6.UNREGULATEDM
  pour Top (rank 2): 312.17,95.25 312.17,100.08 304.29,100.08 304.29,109.47 289.56,109.47 289.56,95.25
POWER_LIPO_POST  (2 unrouted)
  Top 0.254: U6.2 294.92,116.81 J21.P$1 R16.1
  pour Top (rank 3): 264.92,113.79 289.31,113.79 289.31,95 264.92,95
  pour Top: 302.26,136.65 287.53,136.65 287.53,141.73 281.94,141.73 281.94,147.83 302.26,147.83
SCL  (6 unrouted)
  Top 0.406: J17.P$15 J6.SCL
SDA  (6 unrouted)
  Top 0.406: J17.P$14 J6.SDA
SRX0
  Top 0.406: J16.P$17 J6.UART0_RX 58.42,70.61 57.91,70.1 51.61,70.1 J76.P$2
SRX1  (1 unrouted)
  Top 0.406: J6.UART1_RX J16.P$13
STX0
  Top 0.406: J16.P$18 J6.UART0_TX 58.55,69.34 52.83,69.34 52.07,68.58 J77.P$2
STX1  (1 unrouted)
  Top 0.406: J6.UART1_TX J16.P$14
VMOTOR_A2D  (2 unrouted)